# EAGLE schematic borrador_1 (EAGLE 9.5.2)

## Sheet 1 of 2
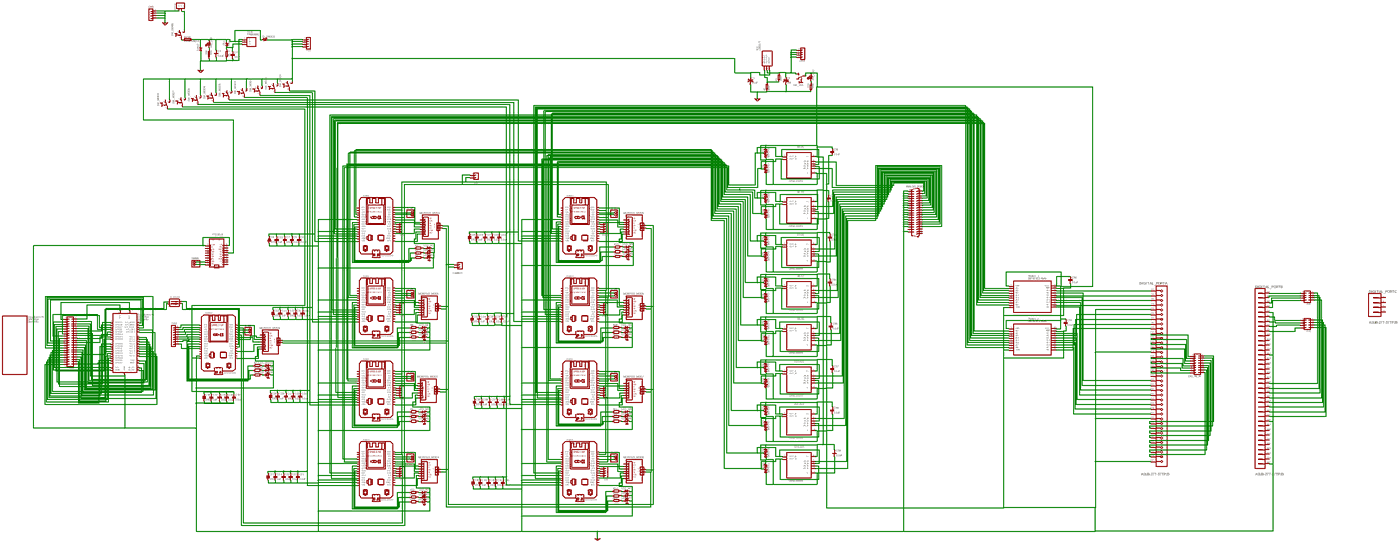
[diagram p0: schematic, sheet 1, overview]
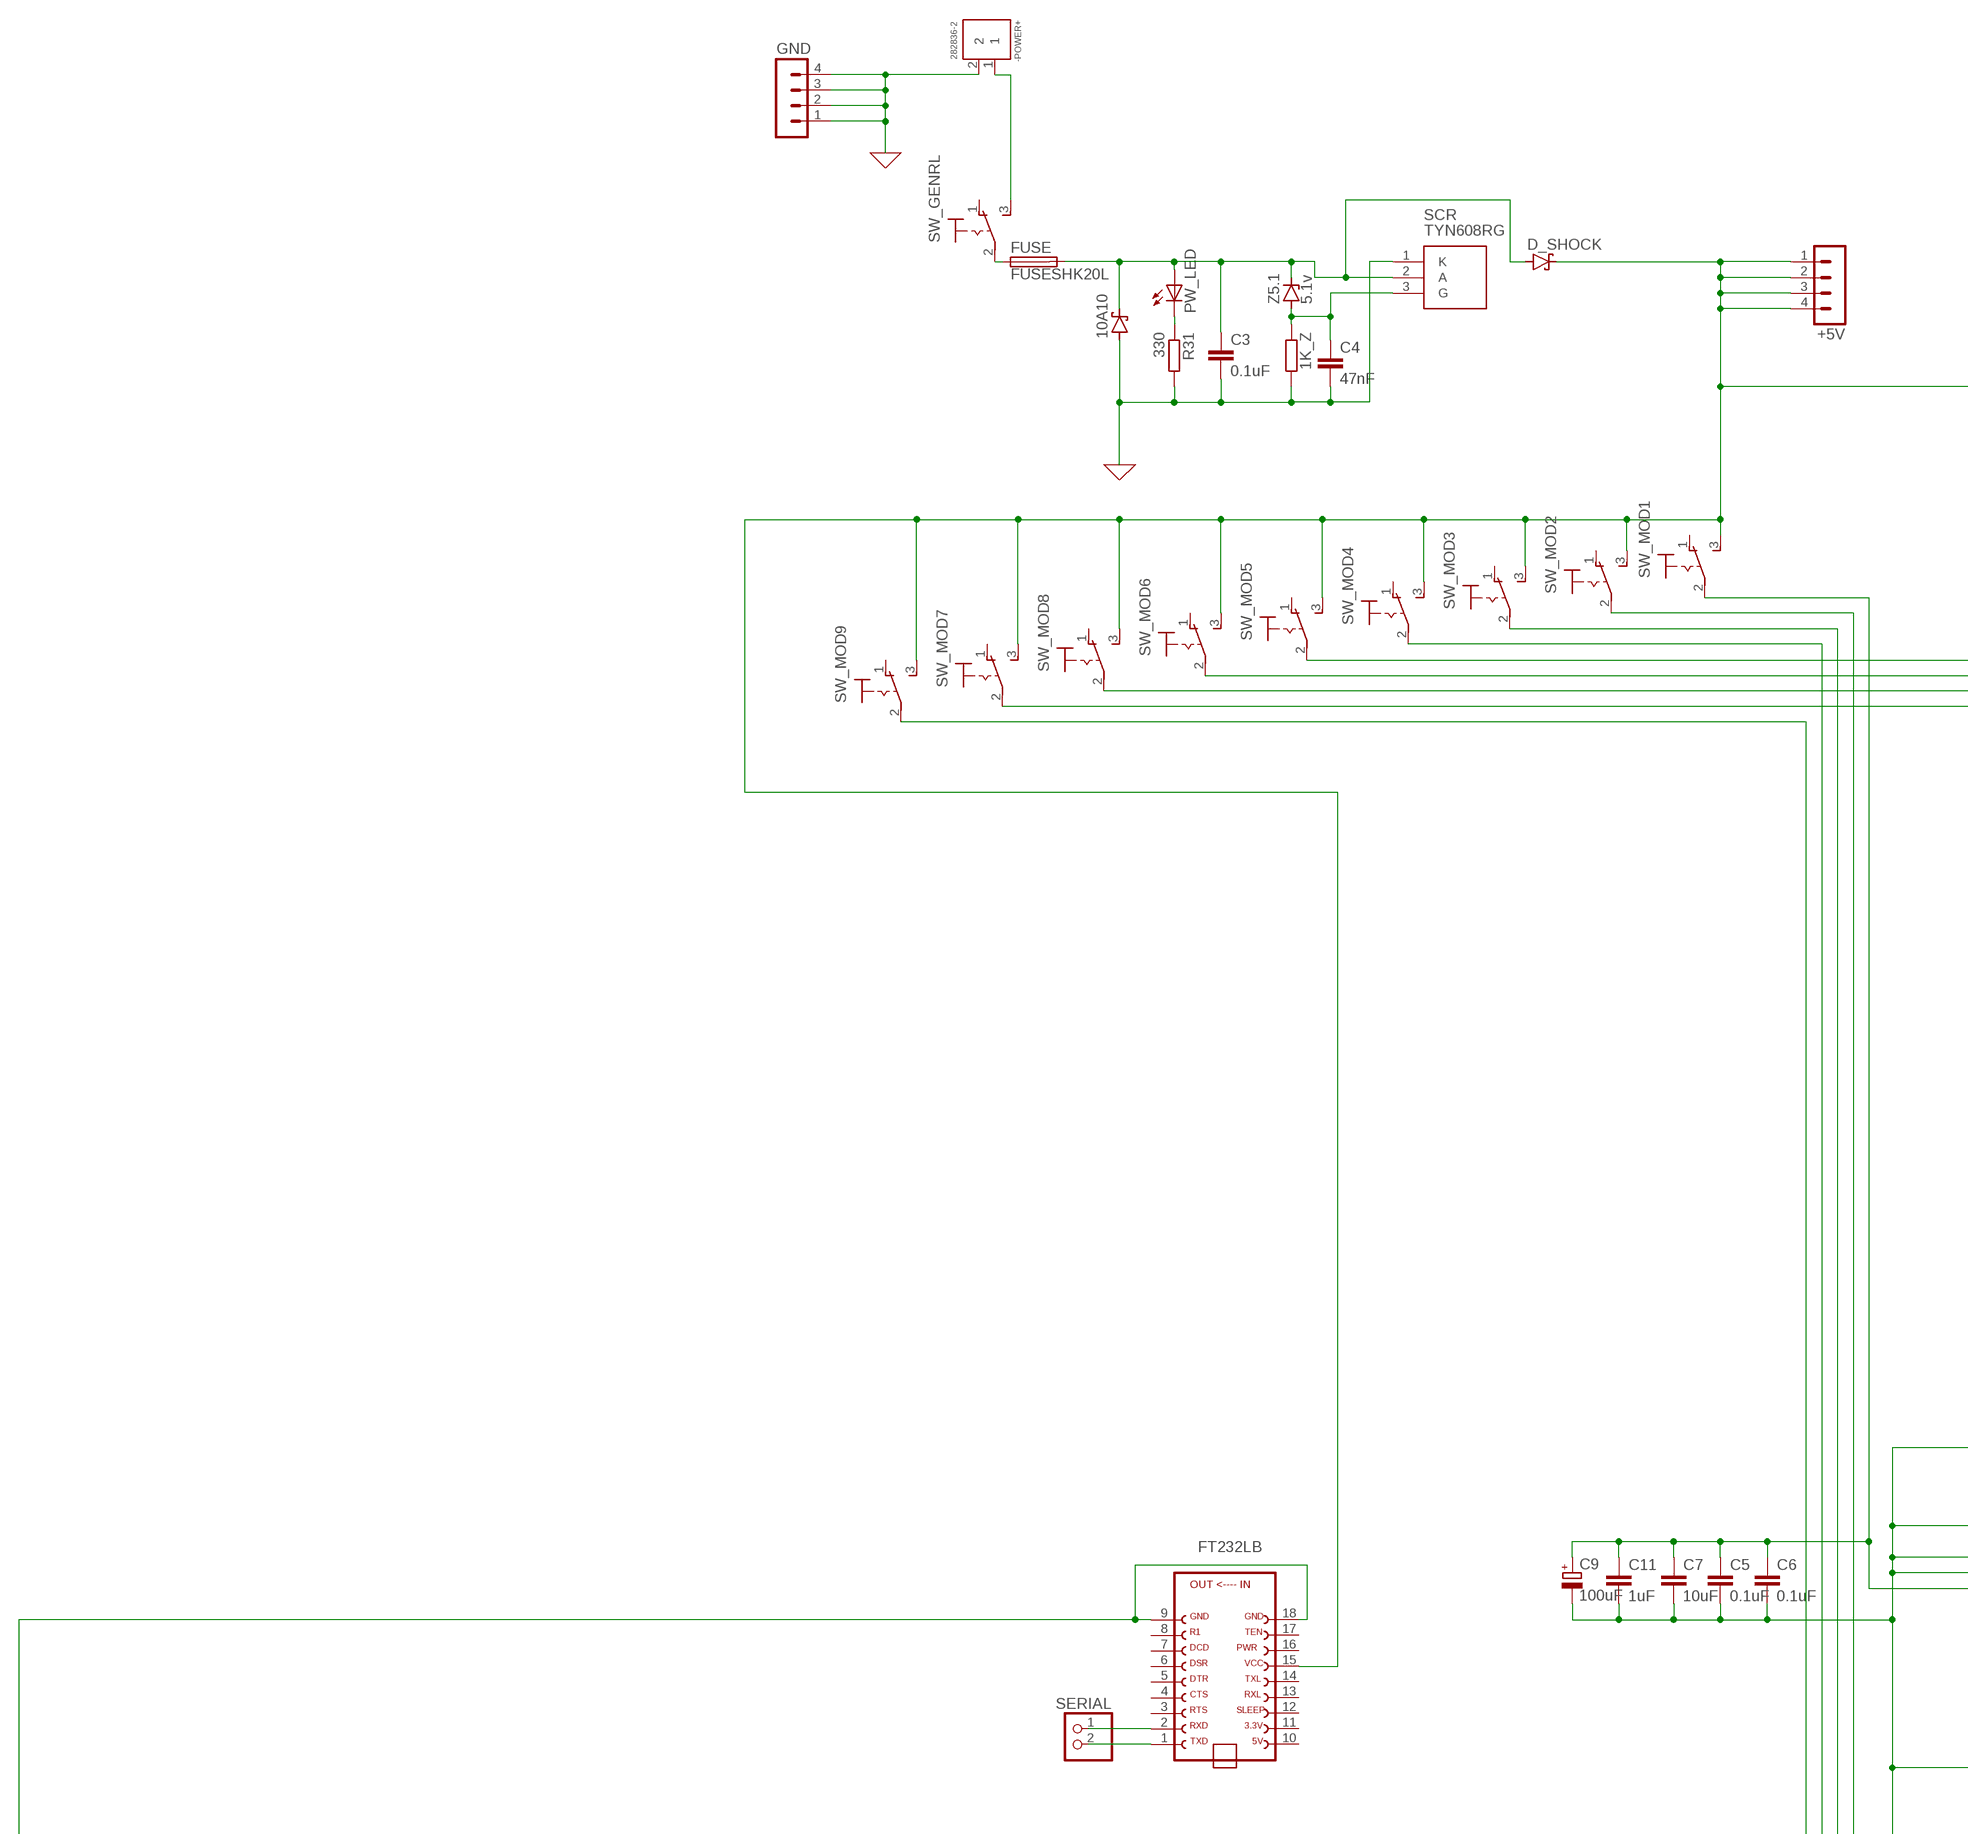
[diagram p1: schematic, sheet 1, part 1 of 6]
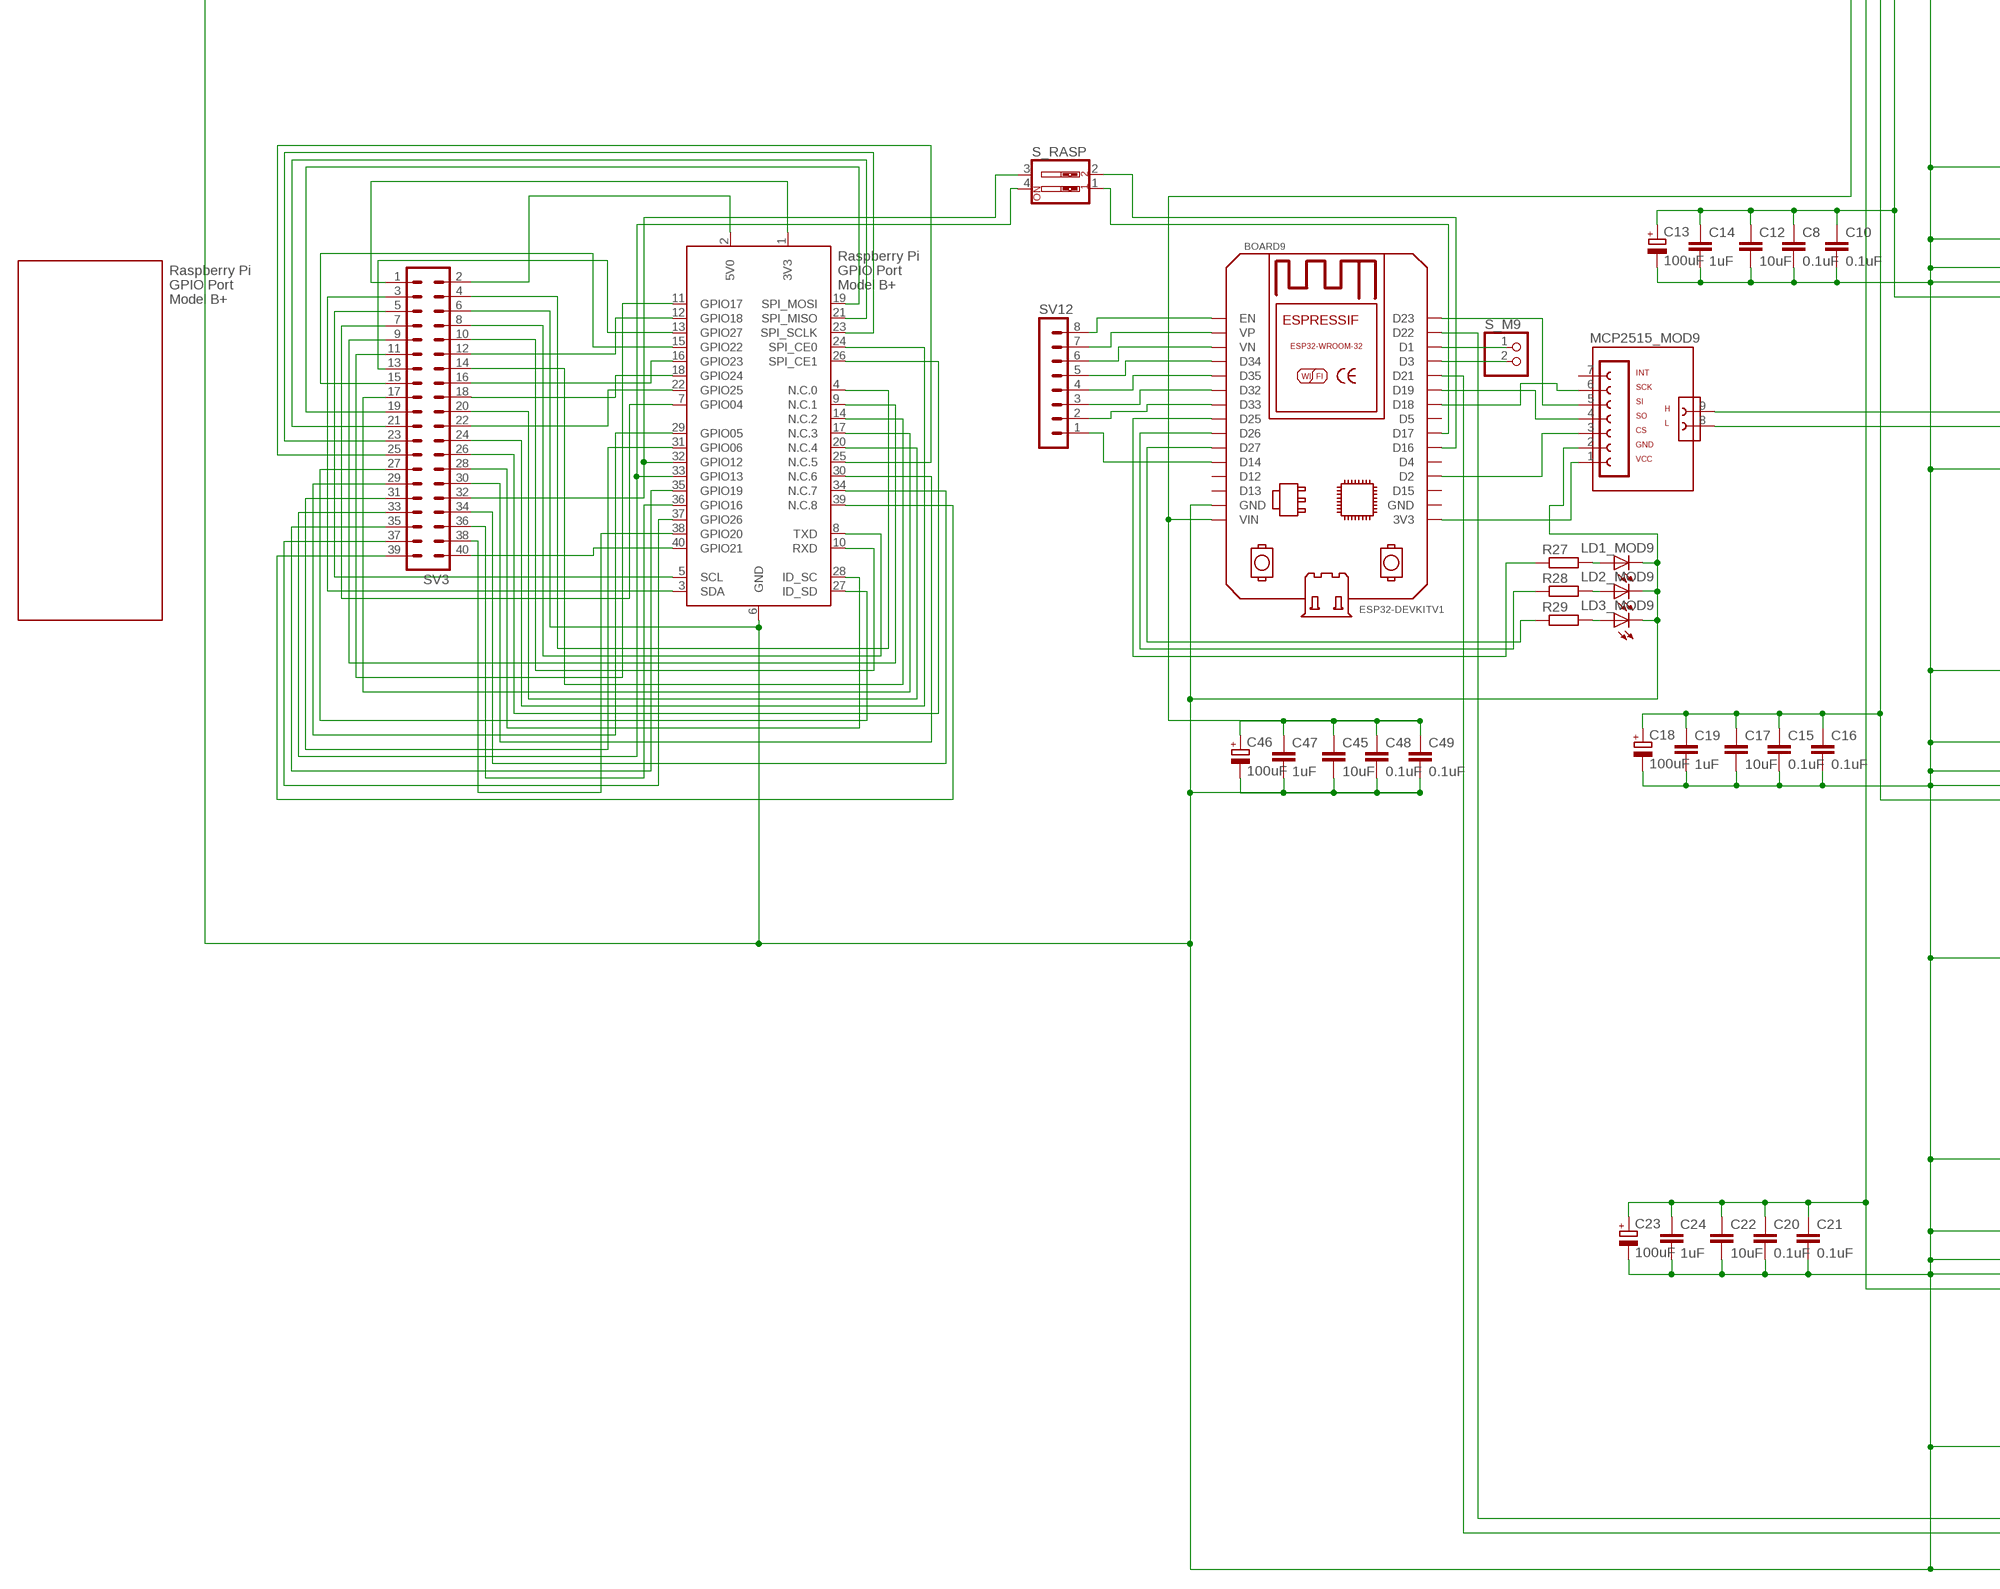
[diagram p2: schematic, sheet 1, part 2 of 6]
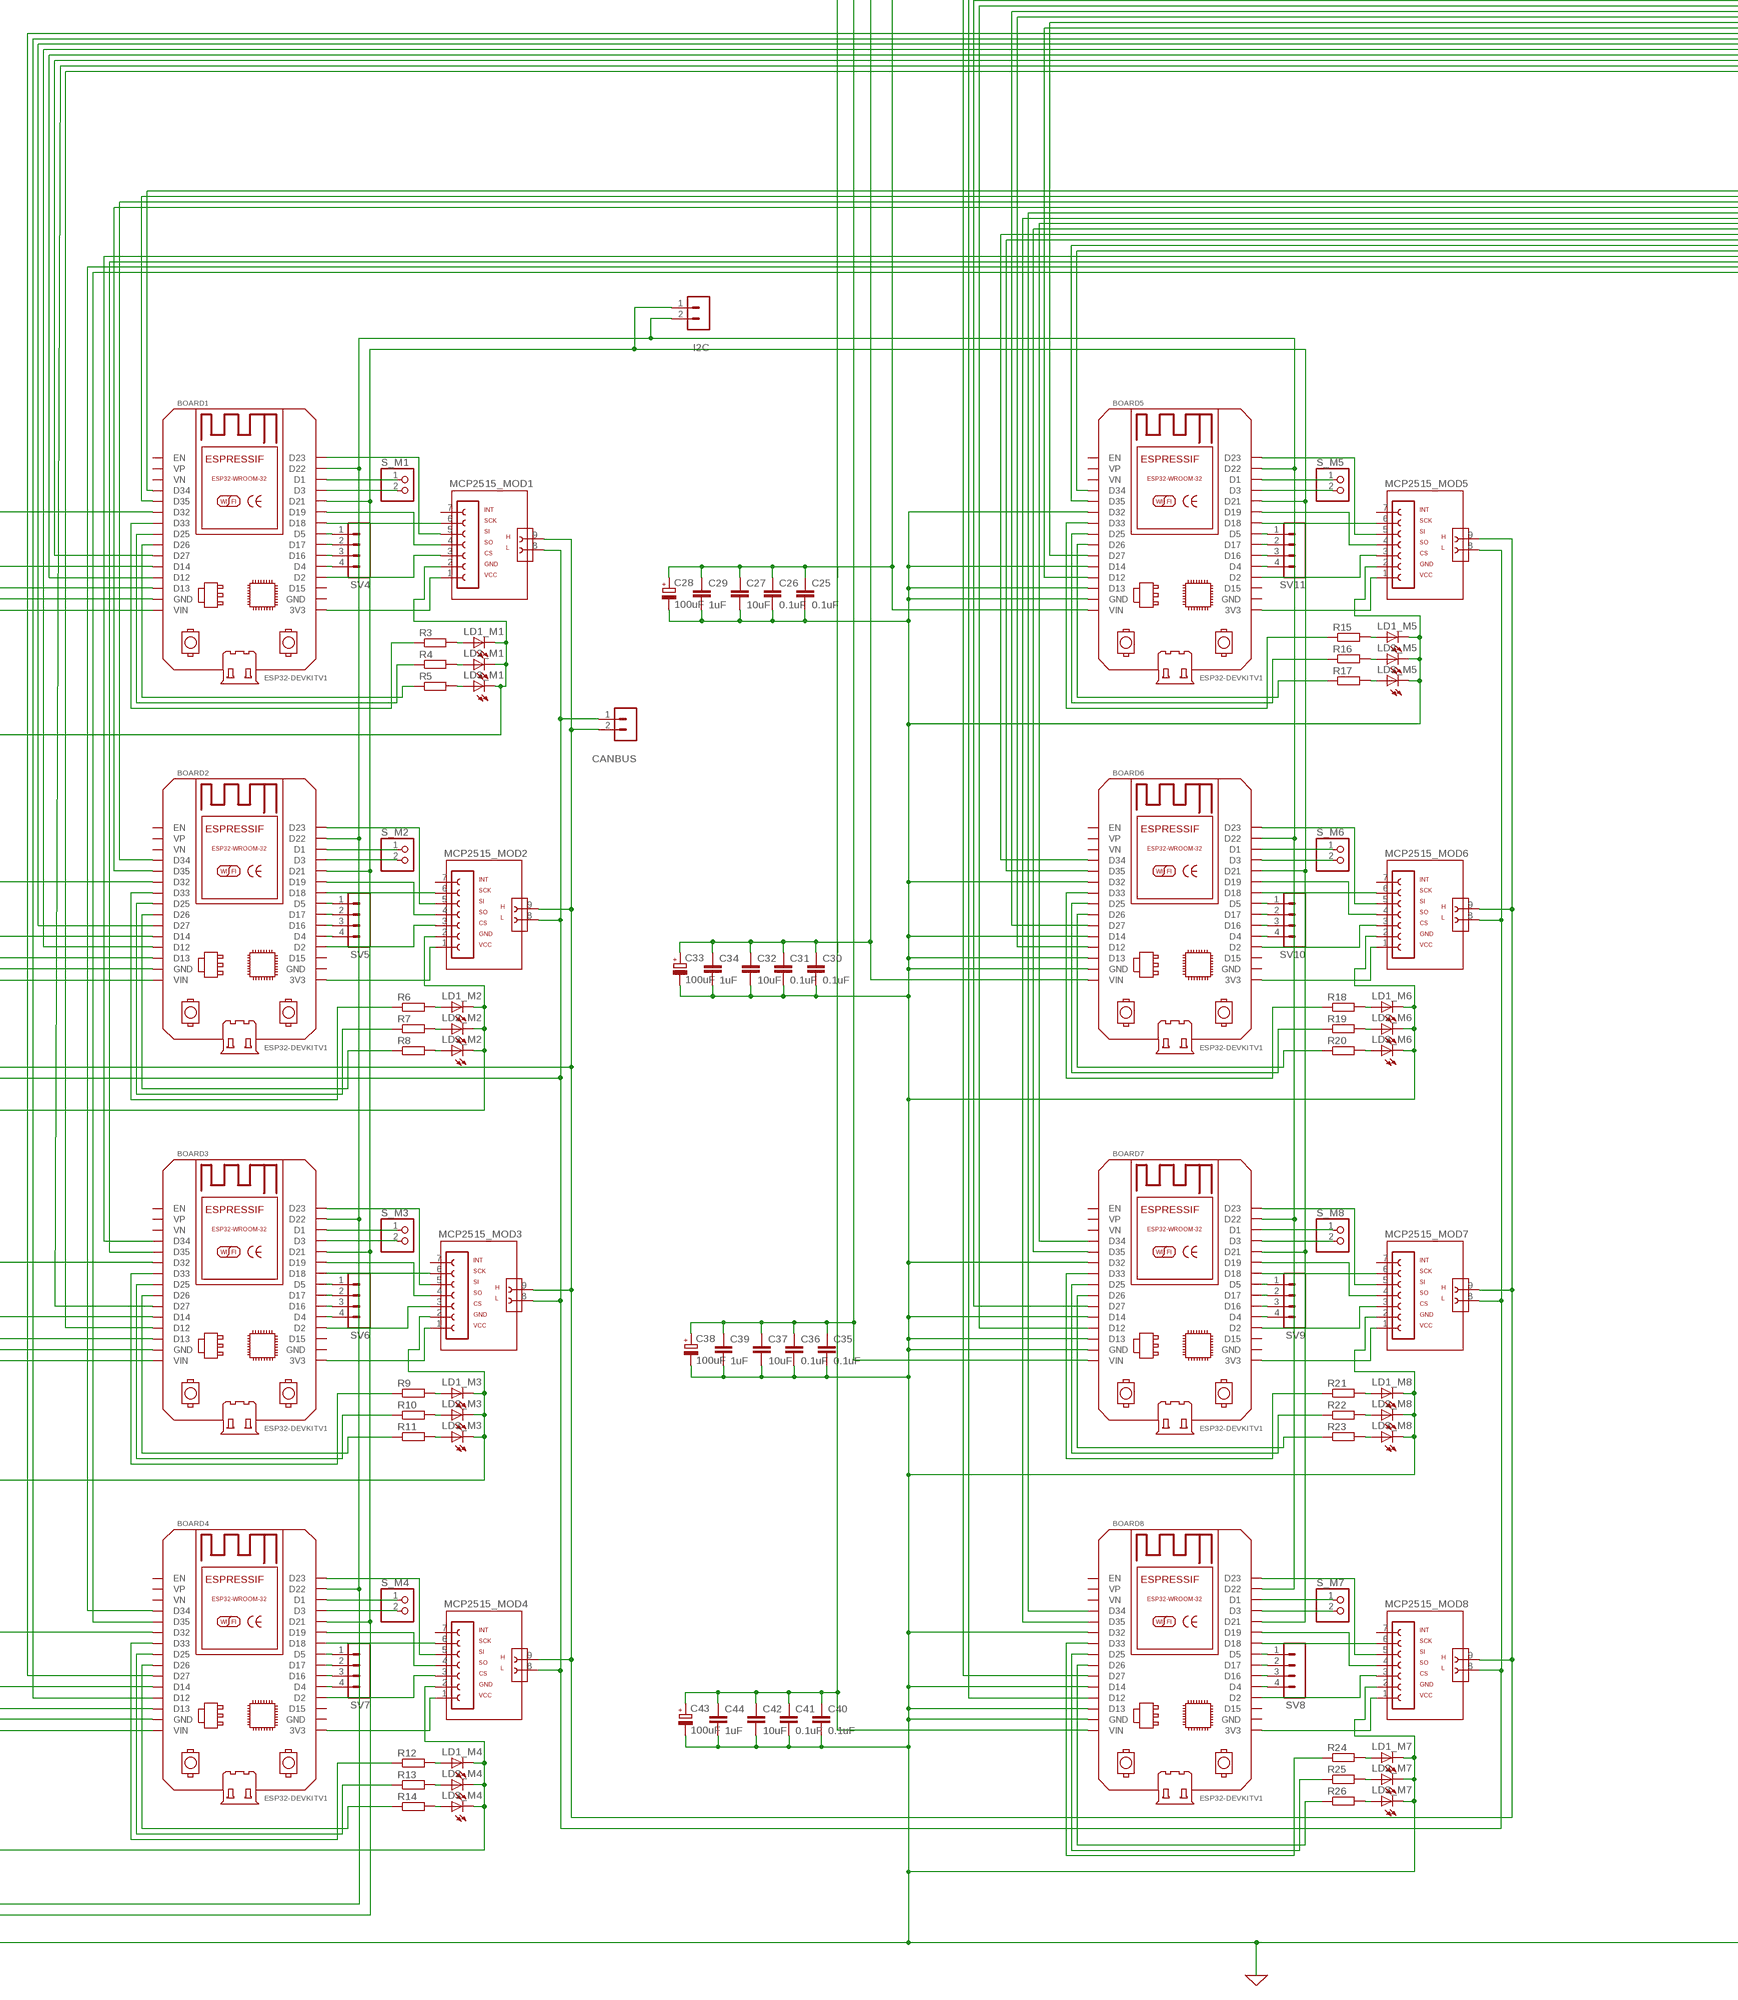
[diagram p3: schematic, sheet 1, part 3 of 6]
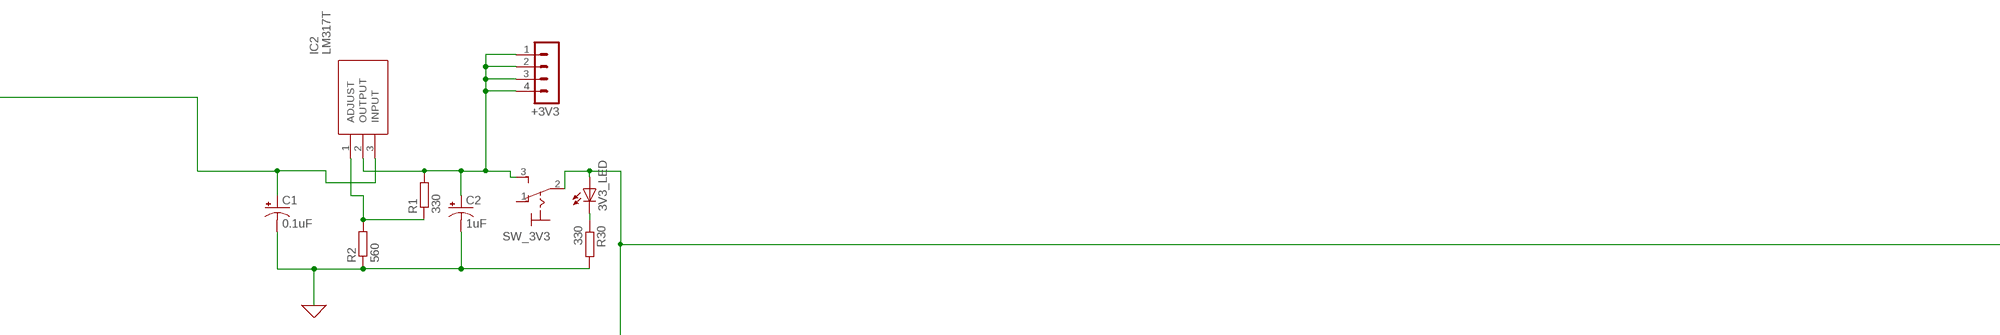
[diagram p4: schematic, sheet 1, part 4 of 6]
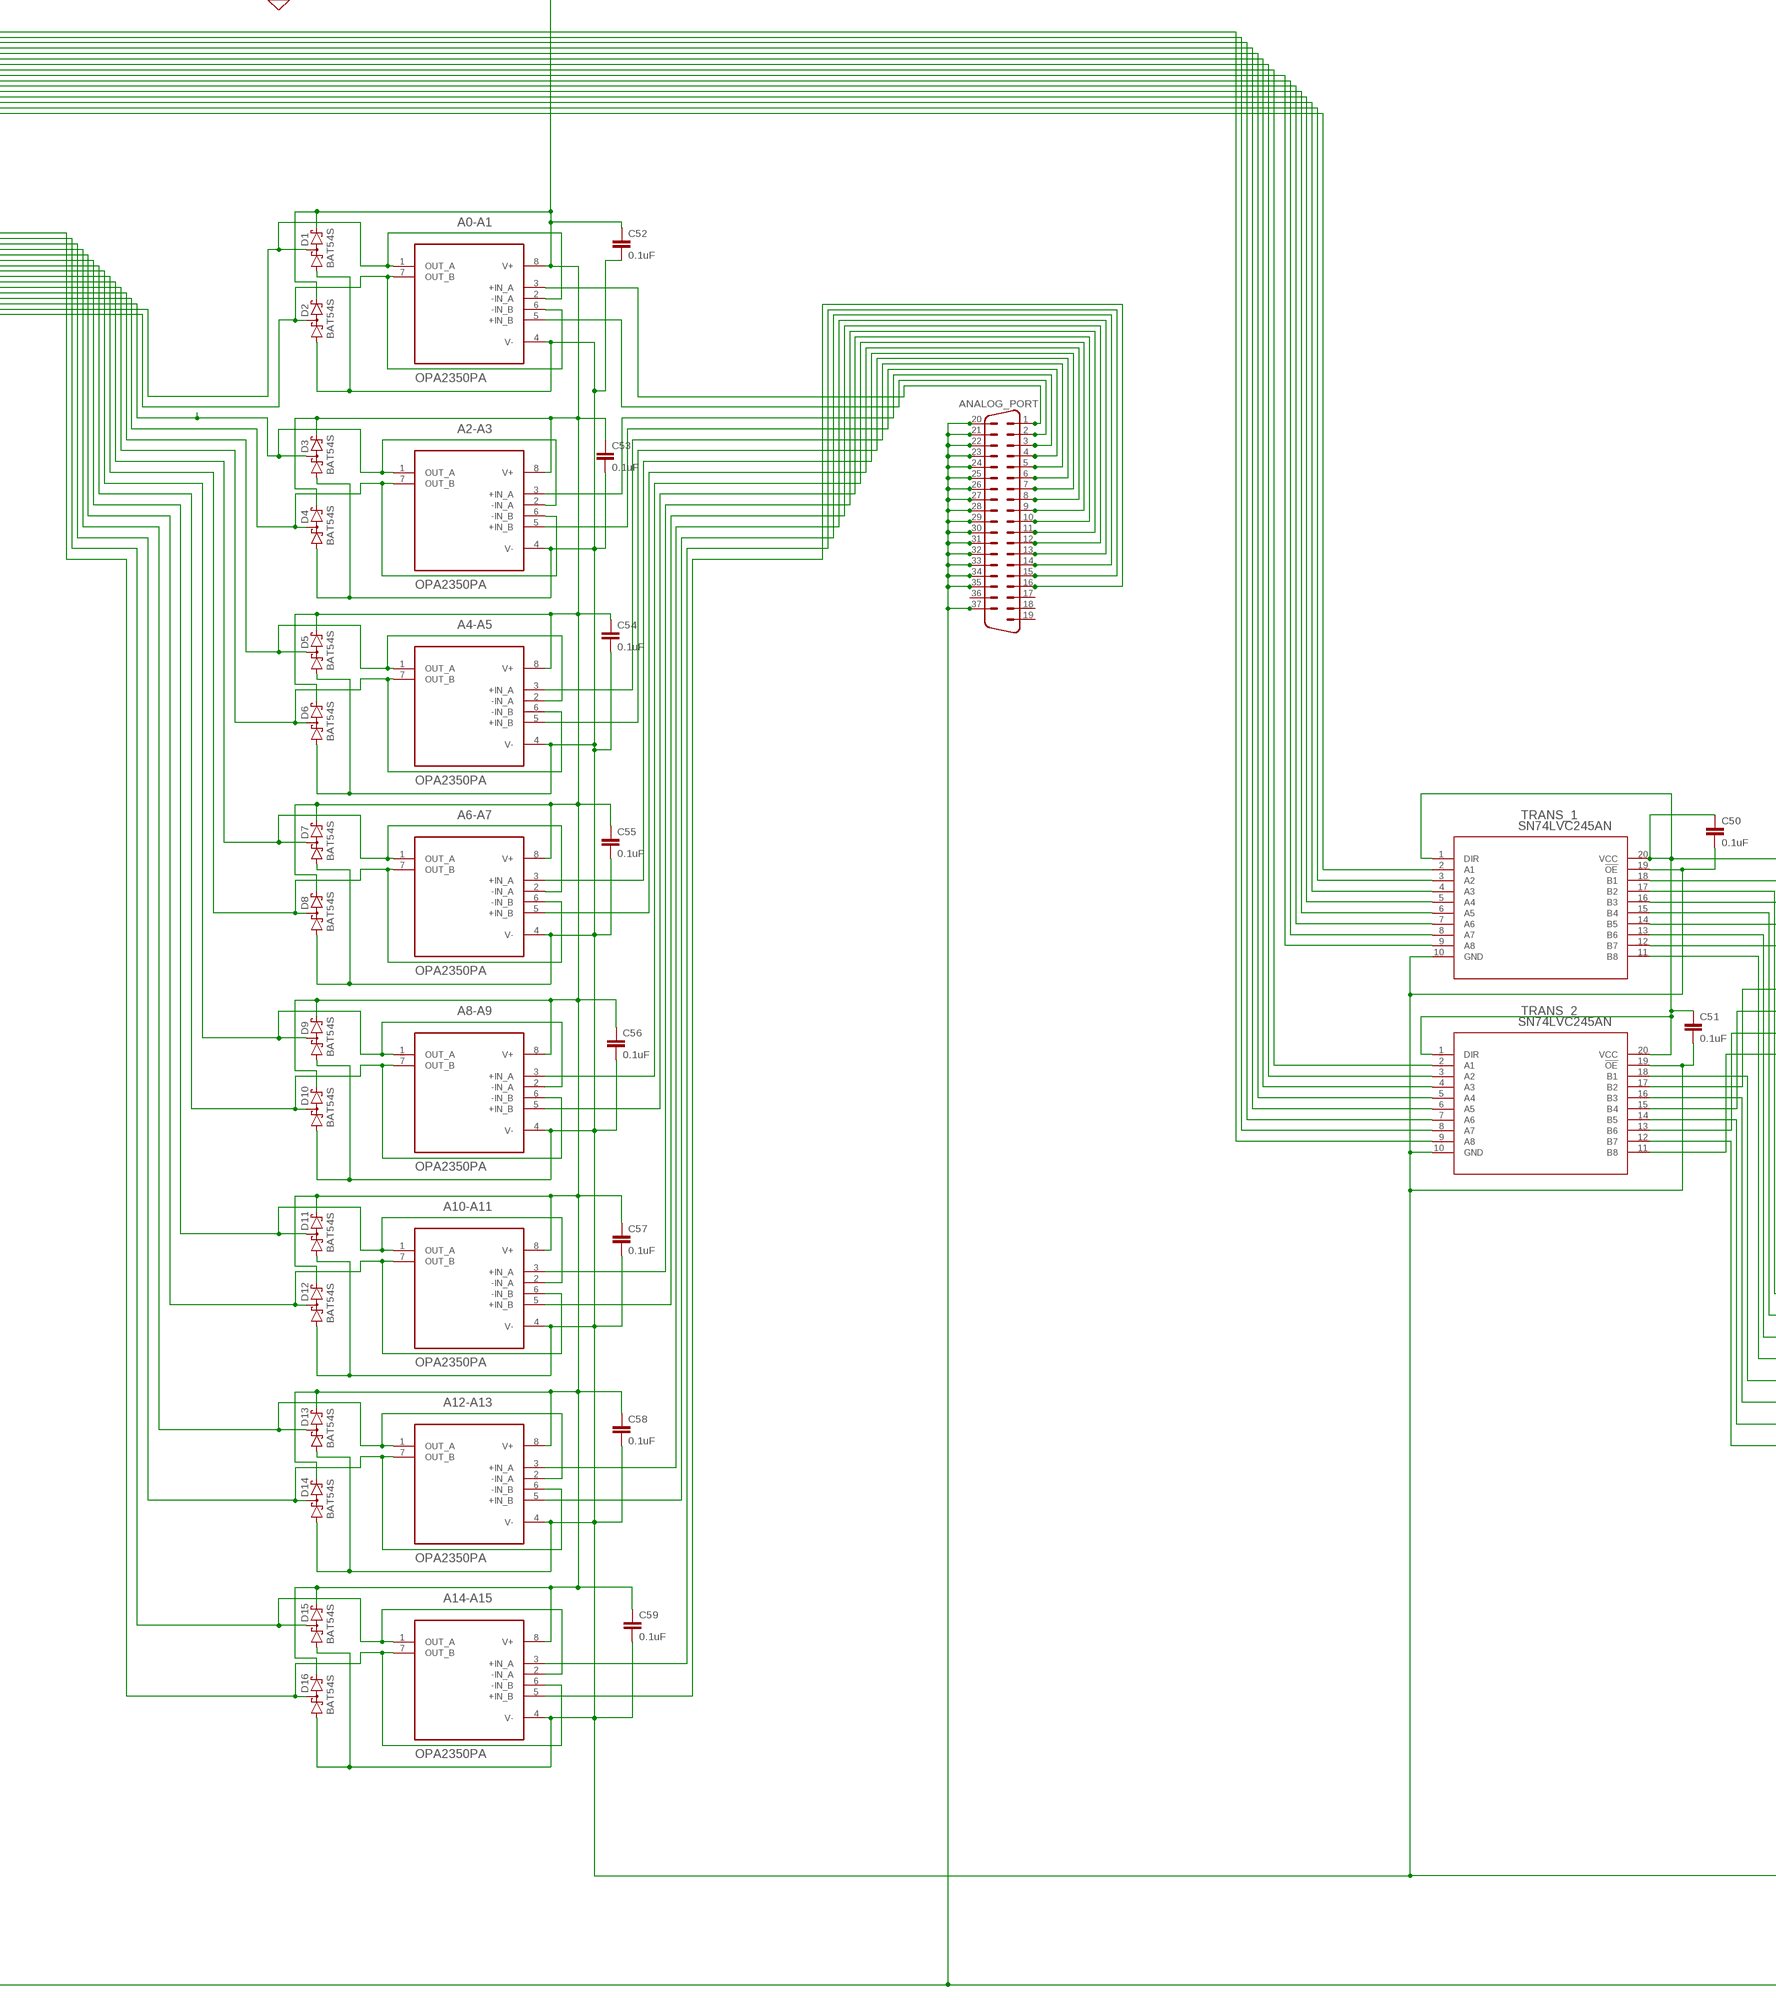
[diagram p5: schematic, sheet 1, part 5 of 6]
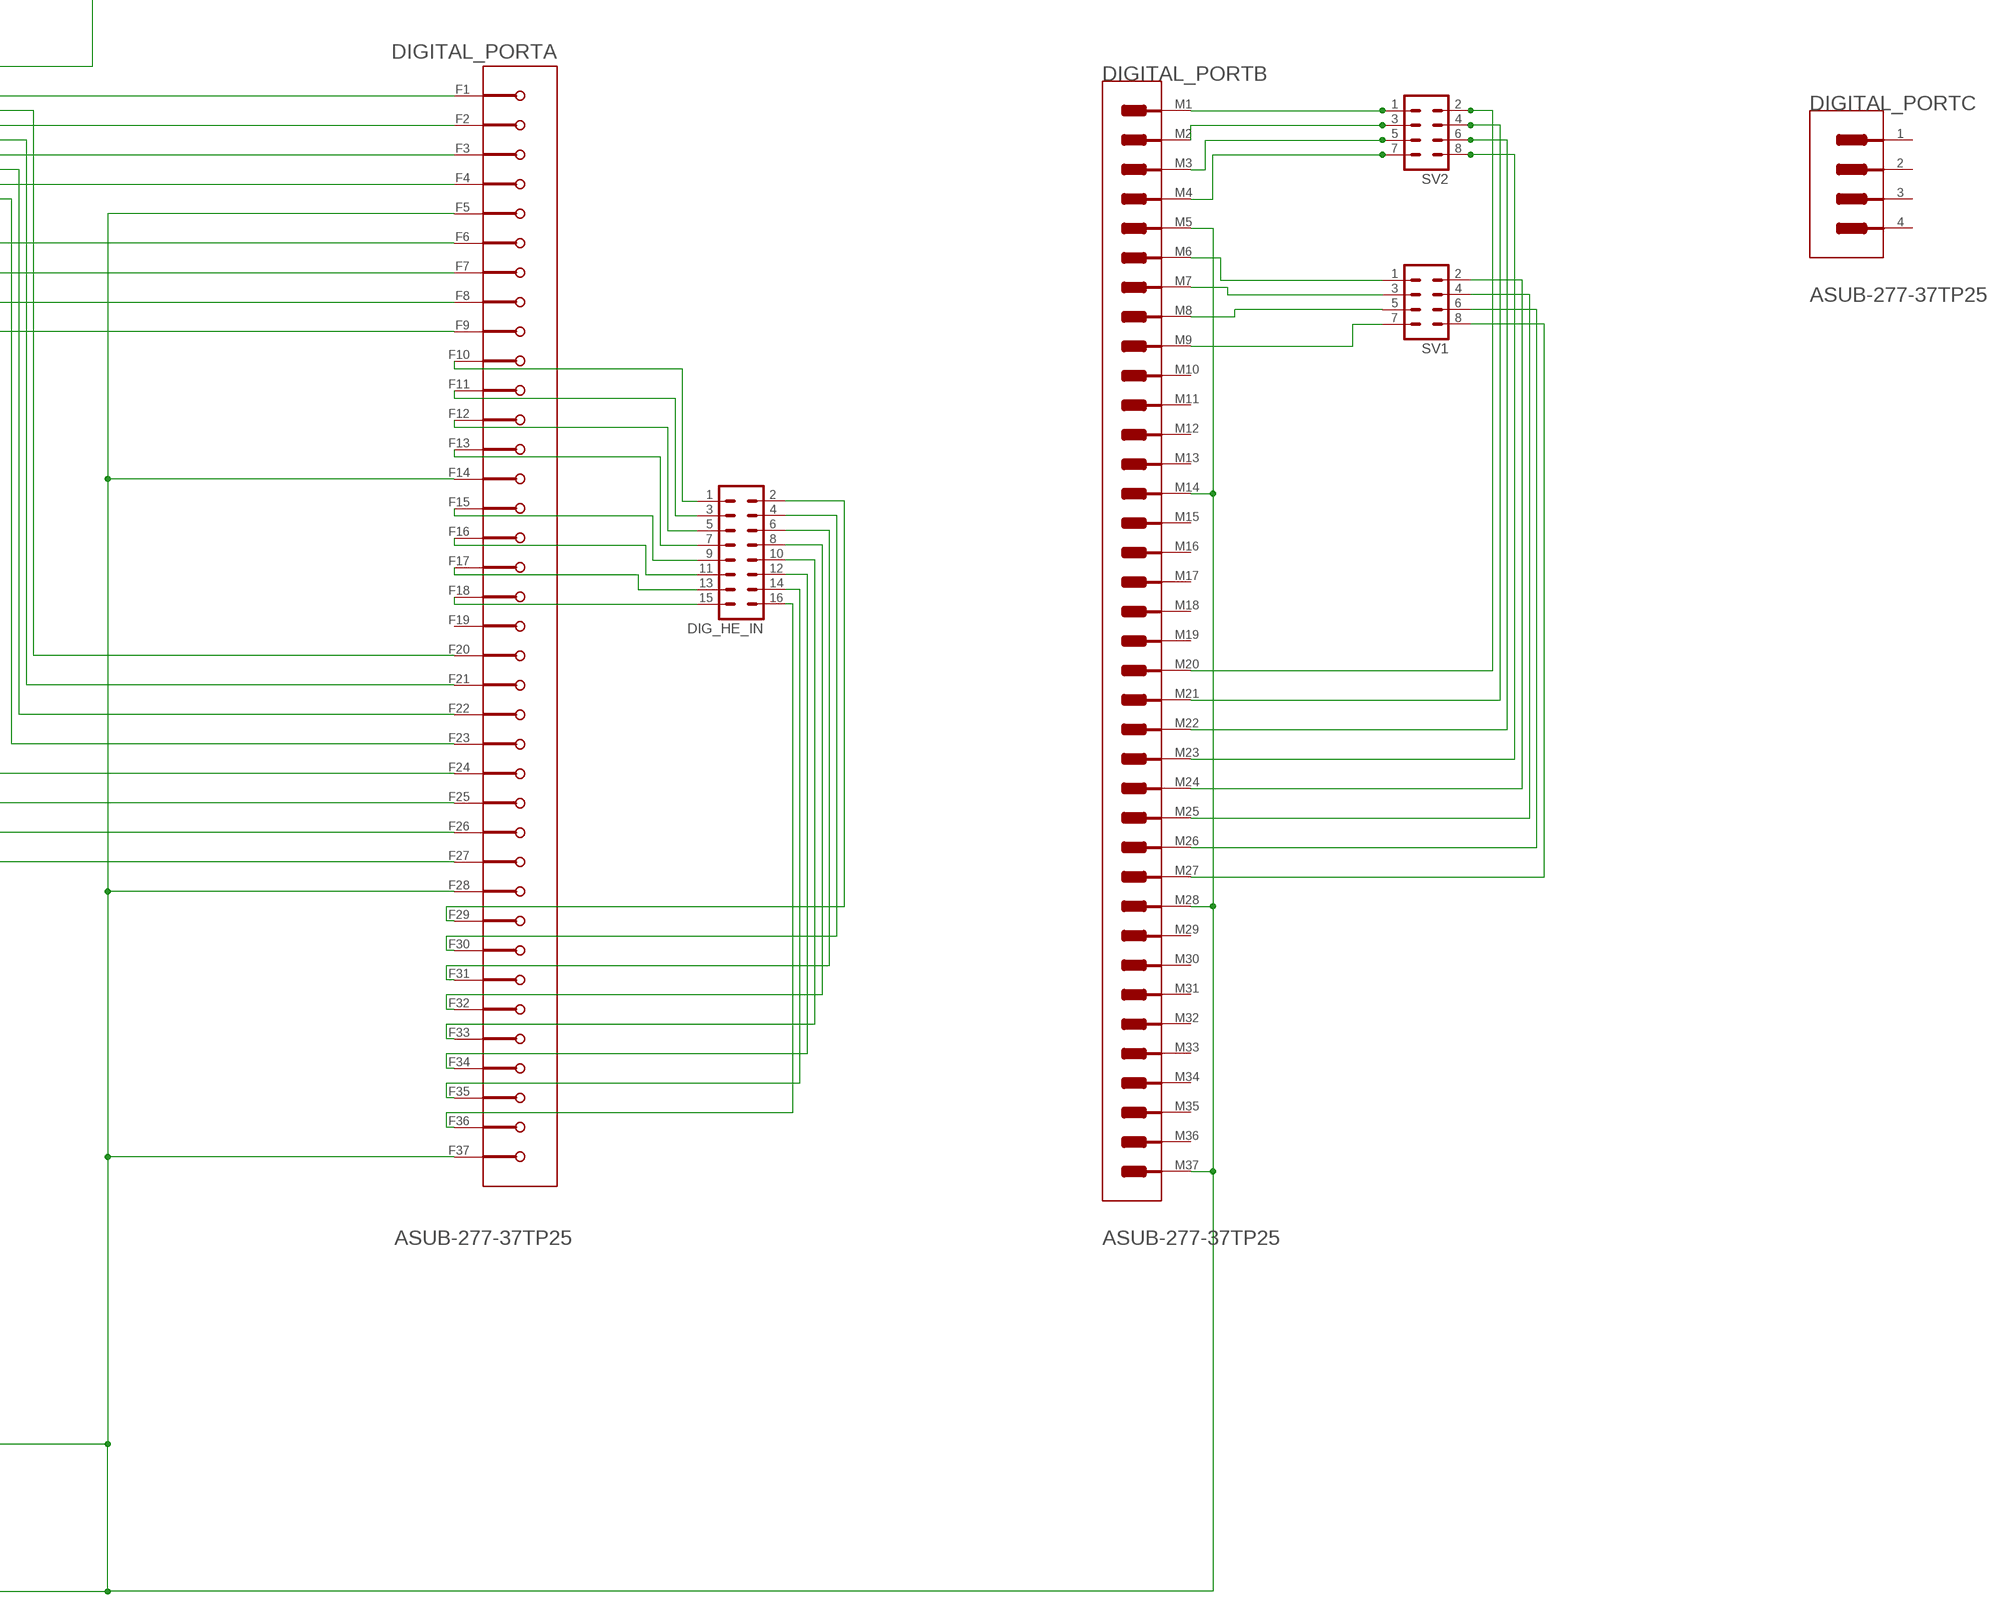
[diagram p6: schematic, sheet 1, part 6 of 6]

### Parts
1K_Z  R-EU_0207/10  [0207/10]
3V3_LED  LED3MM  [LED3MM]
10A10  SCHOTTKY-DIODECB429-15  [CB429-15]
+3V3  MA04-1  [MA04-1]
+5V  MA04-1  [MA04-1]
-POWER+  282836-2  [CONN_282836-2]
A0-A1  OPA2350PA  [DIP254P762X508-8]
A2-A3  OPA2350PA  [DIP254P762X508-8]
A4-A5  OPA2350PA  [DIP254P762X508-8]
A6-A7  OPA2350PA  [DIP254P762X508-8]
A8-A9  OPA2350PA  [DIP254P762X508-8]
A10-A11  OPA2350PA  [DIP254P762X508-8]
A12-A13  OPA2350PA  [DIP254P762X508-8]
A14-A15  OPA2350PA  [DIP254P762X508-8]
ANALOG_PORT  M37HP  [M37HP]
BOARD1  ESP32DEVKITV1  [ESP32-DEVKITV1]
BOARD2  ESP32DEVKITV1  [ESP32-DEVKITV1]
BOARD3  ESP32DEVKITV1  [ESP32-DEVKITV1]
BOARD4  ESP32DEVKITV1  [ESP32-DEVKITV1]
BOARD5  ESP32DEVKITV1  [ESP32-DEVKITV1]
BOARD6  ESP32DEVKITV1  [ESP32-DEVKITV1]
BOARD7  ESP32DEVKITV1  [ESP32-DEVKITV1]
BOARD8  ESP32DEVKITV1  [ESP32-DEVKITV1]
BOARD9  ESP32DEVKITV1  [ESP32-DEVKITV1]
C1  0.1uF  CPOL-USE2.5-6  [E2,5-6]
C2  1uF  CPOL-USE2.5-6  [E2,5-6]
C3  0.1uF  C-EU050-030X075  [C050-030X075]
C4  47nF  C-EU050-030X075  [C050-030X075]
C5  0.1uF  C-EU050-025X075  [C050-025X075]
C6  0.1uF  C-EU050-025X075  [C050-025X075]
C7  10uF  C-EU025-030X050  [C025-030X050]
C8  0.1uF  C-EU050-025X075  [C050-025X075]
C9  100uF  CPOL-EUE2.5-6  [E2,5-6]
C10  0.1uF  C-EU050-025X075  [C050-025X075]
C11  1uF  C-EU050-030X075  [C050-030X075]
C12  10uF  C-EU025-030X050  [C025-030X050]
C13  100uF  CPOL-EUE2.5-6  [E2,5-6]
C14  1uF  C-EU050-030X075  [C050-030X075]
C15  0.1uF  C-EU050-025X075  [C050-025X075]
C16  0.1uF  C-EU050-025X075  [C050-025X075]
C17  10uF  C-EU025-030X050  [C025-030X050]
C18  100uF  CPOL-EUE2.5-6  [E2,5-6]
C19  1uF  C-EU050-030X075  [C050-030X075]
C20  0.1uF  C-EU050-025X075  [C050-025X075]
C21  0.1uF  C-EU050-025X075  [C050-025X075]
C22  10uF  C-EU025-030X050  [C025-030X050]
C23  100uF  CPOL-EUE2.5-6  [E2,5-6]
C24  1uF  C-EU050-030X075  [C050-030X075]
C25  0.1uF  C-EU050-025X075  [C050-025X075]
C26  0.1uF  C-EU050-025X075  [C050-025X075]
C27  10uF  C-EU025-030X050  [C025-030X050]
C28  100uF  CPOL-EUE2.5-6  [E2,5-6]
C29  1uF  C-EU050-030X075  [C050-030X075]
C30  0.1uF  C-EU050-025X075  [C050-025X075]
C31  0.1uF  C-EU050-025X075  [C050-025X075]
C32  10uF  C-EU025-030X050  [C025-030X050]
C33  100uF  CPOL-EUE2.5-6  [E2,5-6]
C34  1uF  C-EU050-030X075  [C050-030X075]
C35  0.1uF  C-EU050-025X075  [C050-025X075]
C36  0.1uF  C-EU050-025X075  [C050-025X075]
C37  10uF  C-EU025-030X050  [C025-030X050]
C38  100uF  CPOL-EUE2.5-6  [E2,5-6]
C39  1uF  C-EU050-030X075  [C050-030X075]
C40  0.1uF  C-EU050-025X075  [C050-025X075]
C41  0.1uF  C-EU050-025X075  [C050-025X075]
C42  10uF  C-EU025-030X050  [C025-030X050]
C43  100uF  CPOL-EUE2.5-6  [E2,5-6]
C44  1uF  C-EU050-030X075  [C050-030X075]
C45  10uF  C-EU025-030X050  [C025-030X050]
C46  100uF  CPOL-EUE2.5-6  [E2,5-6]
C47  1uF  C-EU050-030X075  [C050-030X075]
C48  0.1uF  C-EU050-025X075  [C050-025X075]
C49  0.1uF  C-EU050-025X075  [C050-025X075]
C50  0.1uF  C-EU025-030X050  [C025-030X050]
C51  0.1uF  C-EU025-030X050  [C025-030X050]
C52  0.1uF  C-EU050-025X075  [C050-025X075]
C53  0.1uF  C-EU050-025X075  [C050-025X075]
C54  0.1uF  C-EU050-025X075  [C050-025X075]
C55  0.1uF  C-EU050-025X075  [C050-025X075]
C56  0.1uF  C-EU050-025X075  [C050-025X075]
C57  0.1uF  C-EU050-025X075  [C050-025X075]
C58  0.1uF  C-EU050-025X075  [C050-025X075]
C59  0.1uF  C-EU050-025X075  [C050-025X075]
CANBUS  MA02-1  [MA02-1]
D1  BAT54S  [SOT23]
D2  BAT54S  [SOT23]
D3  BAT54S  [SOT23]
D4  BAT54S  [SOT23]
D5  BAT54S  [SOT23]
D6  BAT54S  [SOT23]
D7  BAT54S  [SOT23]
D8  BAT54S  [SOT23]
D9  BAT54S  [SOT23]
D10  BAT54S  [SOT23]
D11  BAT54S  [SOT23]
D12  BAT54S  [SOT23]
D13  BAT54S  [SOT23]
D14  BAT54S  [SOT23]
D15  BAT54S  [SOT23]
D16  BAT54S  [SOT23]
D_SHOCK  SCHOTTKY-DIODECB429-15  [CB429-15]
DIG_HE_IN  MA08-2  [MA08-2]
DIGITAL_PORT  ASSMANN_WSW_COMPONENTS_ASUB-277-37TP25ASSMANN_WSW_COMPONENTS_ASUB-277-37TP25_0_0  [ASSMANN_WSW_COMPONENTS_ASUB-277-37TP25_0]
FT232LB  FT232BL  [FT232BL]
FUSE  FUSESHK20L  [SHK20L]
GND  MA04-1  [MA04-1]
I2C  MA02-1  [MA02-1]
IC2  LM317T  [TO255P460X1020X2008-3P]
LD1_M1  LED3MM  [LED3MM]
LD1_M2  LED3MM  [LED3MM]
LD1_M3  LED3MM  [LED3MM]
LD1_M4  LED3MM  [LED3MM]
LD1_M5  LED3MM  [LED3MM]
LD1_M6  LED3MM  [LED3MM]
LD1_M7  LED3MM  [LED3MM]
LD1_M8  LED3MM  [LED3MM]
LD1_MOD9  LED3MM  [LED3MM]
LD2_M1  LED3MM  [LED3MM]
LD2_M2  LED3MM  [LED3MM]
LD2_M3  LED3MM  [LED3MM]
LD2_M4  LED3MM  [LED3MM]
LD2_M5  LED3MM  [LED3MM]
LD2_M6  LED3MM  [LED3MM]
LD2_M7  LED3MM  [LED3MM]
LD2_M8  LED3MM  [LED3MM]
LD2_MOD9  LED3MM  [LED3MM]
LD3_M1  LED3MM  [LED3MM]
LD3_M2  LED3MM  [LED3MM]
LD3_M3  LED3MM  [LED3MM]
LD3_M4  LED3MM  [LED3MM]
LD3_M5  LED3MM  [LED3MM]
LD3_M6  LED3MM  [LED3MM]
LD3_M7  LED3MM  [LED3MM]
LD3_M8  LED3MM  [LED3MM]
LD3_MOD9  LED3MM  [LED3MM]
MCP2515_MOD1  MCP2515  [MCP2515]
MCP2515_MOD2  MCP2515  [MCP2515]
MCP2515_MOD3  MCP2515  [MCP2515]
MCP2515_MOD4  MCP2515  [MCP2515]
MCP2515_MOD5  MCP2515  [MCP2515]
MCP2515_MOD6  MCP2515  [MCP2515]
MCP2515_MOD7  MCP2515  [MCP2515]
MCP2515_MOD8  MCP2515  [MCP2515]
MCP2515_MOD9  MCP2515  [MCP2515]
PW_LED  LED3MM  [LED3MM]
R1  330  R-EU_0411/15  [0411/15]
R2  560  R-EU_0411/15  [0411/15]
R3  R-EU_0207/10  [0207/10]
R4  R-EU_0207/10  [0207/10]
R5  R-EU_0207/10  [0207/10]
R6  R-EU_0207/10  [0207/10]
R7  R-EU_0207/10  [0207/10]
R8  R-EU_0207/10  [0207/10]
R9  R-EU_0207/10  [0207/10]
R10  R-EU_0207/10  [0207/10]
R11  R-EU_0207/10  [0207/10]
R12  R-EU_0207/10  [0207/10]
R13  R-EU_0207/10  [0207/10]
R14  R-EU_0207/10  [0207/10]
R15  R-EU_0207/10  [0207/10]
R16  R-EU_0207/10  [0207/10]
R17  R-EU_0207/10  [0207/10]
R18  R-EU_0207/10  [0207/10]
R19  R-EU_0207/10  [0207/10]
R20  R-EU_0207/10  [0207/10]
R21  R-EU_0207/10  [0207/10]
R22  R-EU_0207/10  [0207/10]
R23  R-EU_0207/10  [0207/10]
R24  R-EU_0207/10  [0207/10]
R25  R-EU_0207/10  [0207/10]
R26  R-EU_0207/10  [0207/10]
R27  R-EU_0207/10  [0207/10]
R28  R-EU_0207/10  [0207/10]
R29  R-EU_0207/10  [0207/10]
R30  330  R-EU_0207/10  [0207/10]
R31  330  R-EU_0207/10  [0207/10]
S_M1  PINHD-1X2  [1X02]
S_M2  PINHD-1X2  [1X02]
S_M3  PINHD-1X2  [1X02]
S_M4  PINHD-1X2  [1X02]
S_M5  PINHD-1X2  [1X02]
S_M6  PINHD-1X2  [1X02]
S_M7  PINHD-1X2  [1X02]
S_M8  PINHD-1X2  [1X02]
S_M9  PINHD-1X2  [1X02]
S_RASP  SW_DIP-2  [EDG-02]
SCR  TYN608RG  [TO270P460X1020X2008-3P]
SERIAL  PINHD-1X2  [1X02]
SV1  MA04-2  [MA04-2]
SV2  MA04-2  [MA04-2]
SV3  MA20-2  [MA20-2]
SV4  MA04-1  [MA04-1]
SV5  MA04-1  [MA04-1]
SV6  MA04-1  [MA04-1]
SV7  MA04-1  [MA04-1]
SV8  MA04-1  [MA04-1]
SV9  MA04-1  [MA04-1]
SV10  MA04-1  [MA04-1]
SV11  MA04-1  [MA04-1]
SV12  MA08-1  [MA08-1]
SW_3V3  M9040P  [M9040P]
SW_GENRL  M9040P  [M9040P]
SW_MOD1  M9040P  [M9040P]
SW_MOD2  M9040P  [M9040P]
SW_MOD3  M9040P  [M9040P]
SW_MOD4  M9040P  [M9040P]
SW_MOD5  M9040P  [M9040P]
SW_MOD6  M9040P  [M9040P]
SW_MOD7  M9040P  [M9040P]
SW_MOD8  M9040P  [M9040P]
SW_MOD9  M9040P  [M9040P]
TRANS_1  SN74LVC245AN  [N20]
TRANS_2  SN74LVC245AN  [N20]
X1  RASPI_GPIO_B+_BOX  [RASPI_GPIO_B+_BOX]
X2  RASPI_BOARD_B+#_F  [RASPI_BOARD_B+_FULL]
Z5.1  5.1v  ZENER-DIODEDO41Z10  [DO41Z10]

### Nets
3V: +3V3.1 +3V3.2 +3V3.3 +3V3.4 C2.+ IC2.2(OUTPUT) R1.2 SW_3V3.3(S)
5V: +5V.1 +5V.2 +5V.3 +5V.4 C1.+ D_SHOCK.C FT232LB.15 IC2.3(INPUT) SW_MOD1.3(S) SW_MOD2.3(S) SW_MOD3.3(S) SW_MOD4.3(S) SW_MOD5.3(S) SW_MOD6.3(S) SW_MOD7.3(S) SW_MOD8.3(S) SW_MOD9.3(S)
5V_MOD1: BOARD1.VIN C5.1 C6.1 C7.1 C9.+ C11.1 SW_MOD1.2(P)
5V_MOD2: BOARD2.VIN C8.1 C10.1 C12.1 C13.+ C14.1 SW_MOD2.2(P)
5V_MOD3: BOARD3.VIN C15.1 C16.1 C17.1 C18.+ C19.1 SW_MOD3.2(P)
5V_MOD4: BOARD4.VIN C20.1 C21.1 C22.1 C23.+ C24.1 SW_MOD4.2(P)
5V_MOD5: BOARD5.VIN C25.1 C26.1 C27.1 C28.+ C29.1 SW_MOD5.2(P)
5V_MOD6: BOARD6.VIN C30.1 C31.1 C32.1 C33.+ C34.1 SW_MOD6.2(P)
5V_MOD7: BOARD7.VIN C35.1 C36.1 C37.1 C38.+ C39.1 SW_MOD8.2(P)
5V_MOD8: BOARD8.VIN C40.1 C41.1 C42.1 C43.+ C44.1 SW_MOD7.2(P)
5V_MOD9: BOARD9.VIN C45.1 C46.+ C47.1 C48.1 C49.1 SW_MOD9.2(P)
CAN_H: CANBUS.2 MCP2515_MOD1.9 MCP2515_MOD2.9 MCP2515_MOD3.9 MCP2515_MOD4.9 MCP2515_MOD5.9 MCP2515_MOD6.9 MCP2515_MOD7.9 MCP2515_MOD8.9 MCP2515_MOD9.9
CAN_L: CANBUS.1 MCP2515_MOD1.8 MCP2515_MOD2.8 MCP2515_MOD3.8 MCP2515_MOD4.8 MCP2515_MOD5.8 MCP2515_MOD6.8 MCP2515_MOD7.8 MCP2515_MOD8.8 MCP2515_MOD9.8
L_3V3: 3V3_LED.A A0-A1.8(V+) A2-A3.8(V+) A4-A5.8(V+) A6-A7.8(V+) A8-A9.8(V+) A10-A11.8(V+) A12-A13.8(V+) A14-A15.8(V+) C50.1 C51.1 C52.1 C53.1 C54.1 C55.1 C56.1 C57.1 C58.1 C59.1 D1.2(C2) D2.2(C2) D3.2(C2) D4.2(C2) D5.2(C2) D6.2(C2) D7.2(C2) D8.2(C2) D9.2(C2) D10.2(C2) D11.2(C2) D12.2(C2) D13.2(C2) D14.2(C2) D15.2(C2) D16.2(C2) SW_3V3.2(P) TRANS_1.1(DIR) TRANS_1.20(VCC) TRANS_2.1(DIR) TRANS_2.20(VCC)
L_AO_0: A0-A1.1(OUT_A) A0-A1.2(-IN_A) BOARD4.D34 D1.3(C1A2)
L_AO_0_P: A0-A1.3(+IN_A) ANALOG_PORT.1
L_AO_1: A0-A1.6(-IN_B) A0-A1.7(OUT_B) BOARD4.D35 D2.3(C1A2)
L_AO_1_P: A0-A1.5(+IN_B) ANALOG_PORT.2
L_AO_2: A2-A3.1(OUT_A) A2-A3.2(-IN_A) BOARD3.D35 D3.3(C1A2)
L_AO_2_P: A2-A3.3(+IN_A) ANALOG_PORT.3
L_AO_3: A2-A3.6(-IN_B) A2-A3.7(OUT_B) BOARD3.D34 D4.3(C1A2)
L_AO_3_P: A2-A3.5(+IN_B) ANALOG_PORT.4
L_AO_4: A4-A5.1(OUT_A) A4-A5.2(-IN_A) BOARD5.D34 D5.3(C1A2)
L_AO_4_P: A4-A5.3(+IN_A) ANALOG_PORT.5
L_AO_5: A4-A5.6(-IN_B) A4-A5.7(OUT_B) BOARD5.D35 D6.3(C1A2)
L_AO_5_P: A4-A5.5(+IN_B) ANALOG_PORT.6
L_AO_6: A6-A7.1(OUT_A) A6-A7.2(-IN_A) BOARD6.D35 D7.3(C1A2)
L_AO_6_P: A6-A7.3(+IN_A) ANALOG_PORT.7
L_AO_7: A6-A7.6(-IN_B) A6-A7.7(OUT_B) BOARD6.D34 D8.3(C1A2)
L_AO_7_P: A6-A7.5(+IN_B) ANALOG_PORT.8
L_AO_8: A8-A9.1(OUT_A) A8-A9.2(-IN_A) BOARD7.D35 D9.3(C1A2)
L_AO_8_P: A8-A9.3(+IN_A) ANALOG_PORT.9
L_AO_9: A8-A9.6(-IN_B) A8-A9.7(OUT_B) BOARD7.D34 D10.3(C1A2)
L_AO_9_P: A8-A9.5(+IN_B) ANALOG_PORT.10
L_AO_10: A10-A11.1(OUT_A) A10-A11.2(-IN_A) BOARD8.D35 D11.3(C1A2)
L_AO_10_P: A10-A11.3(+IN_A) ANALOG_PORT.11
L_AO_11: A10-A11.6(-IN_B) A10-A11.7(OUT_B) BOARD8.D34 D12.3(C1A2)
L_AO_11_P: A10-A11.5(+IN_B) ANALOG_PORT.12
L_AO_12: A12-A13.1(OUT_A) A12-A13.2(-IN_A) BOARD2.D35 D13.3(C1A2)
L_AO_12_P: A12-A13.3(+IN_A) ANALOG_PORT.13
L_AO_13: A12-A13.6(-IN_B) A12-A13.7(OUT_B) BOARD2.D34 D14.3(C1A2)
L_AO_13_P: A12-A13.5(+IN_B) ANALOG_PORT.14
L_AO_14: A14-A15.1(OUT_A) A14-A15.2(-IN_A) BOARD1.D35 D15.3(C1A2)
L_AO_14_P: A14-A15.3(+IN_A) ANALOG_PORT.15
L_AO_15: A14-A15.6(-IN_B) A14-A15.7(OUT_B) BOARD1.D34 D16.3(C1A2)
L_AO_15_P: A14-A15.5(+IN_B) ANALOG_PORT.16
L_DI_0: BOARD3.D12 TRANS_1.2(A1)
L_DI_0_P: DIGITAL_PORT.F1(A:F1) TRANS_1.18(B1)
L_DI_1: BOARD3.D27 TRANS_1.3(A2)
L_DI_1_P: DIGITAL_PORT.F20(A:F20) TRANS_1.17(B2)
L_DI_2: BOARD1.D27 TRANS_1.4(A3)
L_DI_2_P: DIGITAL_PORT.F2(A:F2) TRANS_1.16(B3)
L_DI_3: BOARD1.D12 TRANS_1.5(A4)
L_DI_3_P: DIGITAL_PORT.F21(A:F21) TRANS_1.15(B4)
L_DI_4: BOARD2.D12 TRANS_1.6(A5)
L_DI_4_P: DIGITAL_PORT.F3(A:F3) TRANS_1.14(B5)
L_DI_5: BOARD2.D27 TRANS_1.7(A6)
L_DI_5_P: DIGITAL_PORT.F22(A:F22) TRANS_1.13(B6)
L_DI_6: BOARD4.D12 TRANS_1.8(A7)
L_DI_6_P: DIGITAL_PORT.F4(A:F4) TRANS_1.12(B7)
L_DI_7: BOARD4.D27 TRANS_1.9(A8)
L_DI_7_P: DIGITAL_PORT.F23(A:F23) TRANS_1.11(B8)
L_DI_8: BOARD5.D12 TRANS_2.2(A1)
L_DI_8_P: DIGITAL_PORT.F24(A:F24) TRANS_2.18(B1)
L_DI_9: BOARD5.D27 TRANS_2.3(A2)
L_DI_9_P: DIGITAL_PORT.F6(A:F6) TRANS_2.17(B2)
L_DI_10: BOARD6.D12 TRANS_2.4(A3)
L_DI_10_P: DIGITAL_PORT.F25(A:F25) TRANS_2.16(B3)
L_DI_11: BOARD6.D27 TRANS_2.5(A4)
L_DI_11_P: DIGITAL_PORT.F7(A:F7) TRANS_2.15(B4)
L_DI_012: BOARD7.D12 TRANS_2.6(A5)
L_DI_12_P: DIGITAL_PORT.F26(A:F26) TRANS_2.14(B5)
L_DI_13: BOARD7.D27 TRANS_2.7(A6)
L_DI_13_P: DIGITAL_PORT.F8(A:F8) TRANS_2.13(B6)
L_DI_014: BOARD8.D12 TRANS_2.8(A7)
L_DI_14_P: DIGITAL_PORT.F27(A:F27) TRANS_2.12(B7)
L_DI_015: BOARD8.D27 TRANS_2.9(A8)
L_DI_15_P: DIGITAL_PORT.F9(A:F9) TRANS_2.11(B8)
L_DI_16_P: DIG_HE_IN.1 DIGITAL_PORT.F10(A:F10)
L_DI_17_P: DIG_HE_IN.2 DIGITAL_PORT.F29(A:F29)
L_DI_18_P: DIG_HE_IN.3 DIGITAL_PORT.F11(A:F11)
L_DI_19_P: DIG_HE_IN.4 DIGITAL_PORT.F30(A:F30)
L_DI_20_P: DIG_HE_IN.5 DIGITAL_PORT.F12(A:F12)
L_DI_21_P: DIG_HE_IN.6 DIGITAL_PORT.F31(A:F31)
L_DI_22_P: DIG_HE_IN.7 DIGITAL_PORT.F13(A:F13)
L_DI_23_P: DIG_HE_IN.8 DIGITAL_PORT.F32(A:F32)
L_DI_24_P: DIG_HE_IN.10 DIGITAL_PORT.F33(A:F33)
L_DI_25_P: DIG_HE_IN.9 DIGITAL_PORT.F15(A:F15)
L_DI_26_P: DIG_HE_IN.12 DIGITAL_PORT.F34(A:F34)
L_DI_27_P: DIG_HE_IN.11 DIGITAL_PORT.F16(A:F16)
L_DI_28_P: DIG_HE_IN.14 DIGITAL_PORT.F35(A:F35)
L_DI_29_P: DIG_HE_IN.13 DIGITAL_PORT.F17(A:F17)
L_DI_31_P: DIG_HE_IN.15 DIGITAL_PORT.F18(A:F18)
L_DO_0_P: DIGITAL_PORT.M1(B:M1) SV2.1
L_DO_1_P: DIGITAL_PORT.M20(B:M20) SV2.2
L_DO_2_P: DIGITAL_PORT.M2(B:M2) SV2.3
L_DO_3_P: DIGITAL_PORT.M21(B:M21) SV2.4
L_DO_4_P: DIGITAL_PORT.M3(B:M3) SV2.5
L_DO_5_P: DIGITAL_PORT.M22(B:M22) SV2.6
L_DO_6_P: DIGITAL_PORT.M4(B:M4) SV2.7
L_DO_7_P: DIGITAL_PORT.M23(B:M23) SV2.8
L_DO_8_P: DIGITAL_PORT.M24(B:M24) SV1.2
L_DO_9_P: DIGITAL_PORT.M6(B:M6) SV1.1
L_DO_10_P: DIGITAL_PORT.M25(B:M25) SV1.4
L_DO_11_P: DIGITAL_PORT.M7(B:M7) SV1.3
L_DO_12_P: DIGITAL_PORT.M26(B:M26) SV1.6
L_DO_13_P: DIGITAL_PORT.M8(B:M8) SV1.5
L_DO_14_P: DIGITAL_PORT.M27(B:M27) SV1.8
L_DO_15_P: DIGITAL_PORT.M9(B:M9) SV1.7
L_GROUND: 1K_Z.2 10A10.A -POWER+.2 A0-A1.4(V-) A2-A3.4(V-) A4-A5.4(V-) A6-A7.4(V-) A8-A9.4(V-) A10-A11.4(V-) A12-A13.4(V-) A14-A15.4(V-) ANALOG_PORT.20 ANALOG_PORT.21 ANALOG_PORT.22 ANALOG_PORT.23 ANALOG_PORT.24 ANALOG_PORT.25 ANALOG_PORT.26 ANALOG_PORT.27 ANALOG_PORT.28 ANALOG_PORT.29 ANALOG_PORT.30 ANALOG_PORT.31 ANALOG_PORT.32 ANALOG_PORT.33 ANALOG_PORT.34 ANALOG_PORT.35 ANALOG_PORT.37 BOARD1.D13 BOARD1.D14 BOARD1.D32 BOARD1.GND BOARD2.D13 BOARD2.D14 BOARD2.D32 BOARD2.GND BOARD3.D13 BOARD3.D14 BOARD3.D32 BOARD3.GND BOARD4.D13 BOARD4.D14 BOARD4.D32 BOARD4.GND BOARD5.D13 BOARD5.D14 BOARD5.D32 BOARD5.GND BOARD6.D13 BOARD6.D14 BOARD6.D32 BOARD6.GND BOARD7.D13 BOARD7.D14 BOARD7.D32 BOARD7.GND BOARD8.D13 BOARD8.D14 BOARD8.D32 BOARD8.GND BOARD9.GND C1.- C2.- C3.2 C4.2 C5.2 C6.2 C7.2 C8.2 C9.- C10.2 C11.2 C12.2 C13.- C14.2 C15.2 C16.2 C17.2 C18.- C19.2 C20.2 C21.2 C22.2 C23.- C24.2 C25.2 C26.2 C27.2 C28.- C29.2 C30.2 C31.2 C32.2 C33.- C34.2 C35.2 C36.2 C37.2 C38.- C39.2 C40.2 C41.2 C42.2 C43.- C44.2 C45.2 C46.- C47.2 C48.2 C49.2 C50.2 C51.2 C52.2 C53.2 C54.2 C55.2 C56.2 C57.2 C58.2 C59.2 D1.1(A1) D2.1(A1) D3.1(A1) D4.1(A1) D5.1(A1) D6.1(A1) D7.1(A1) D8.1(A1) D9.1(A1) D10.1(A1) D11.1(A1) D12.1(A1) D13.1(A1) D14.1(A1) D15.1(A1) D16.1(A1) DIGITAL_PORT.F5(A:F5) DIGITAL_PORT.F14(A:F14) DIGITAL_PORT.F28(A:F28) DIGITAL_PORT.F37(A:F37) DIGITAL_PORT.M5(B:M5) DIGITAL_PORT.M14(B:M14) DIGITAL_PORT.M28(B:M28) DIGITAL_PORT.M37(B:M37) FT232LB.9 FT232LB.18 GND.1 GND.2 GND.3 GND.4 LD1_M1.K(C) LD1_M2.K(C) LD1_M3.K(C) LD1_M4.K(C) LD1_M5.K(C) LD1_M6.K(C) LD1_M7.K(C) LD1_M8.K(C) LD1_MOD9.K(C) LD2_M1.K(C) LD2_M2.K(C) LD2_M3.K(C) LD2_M4.K(C) LD2_M5.K(C) LD2_M6.K(C) LD2_M7.K(C) LD2_M8.K(C) LD2_MOD9.K(C) LD3_M1.K(C) LD3_M2.K(C) LD3_M3.K(C) LD3_M4.K(C) LD3_M5.K(C) LD3_M6.K(C) LD3_M7.K(C) LD3_M8.K(C) LD3_MOD9.K(C) MCP2515_MOD1.2 MCP2515_MOD2.2 MCP2515_MOD3.2 MCP2515_MOD4.2 MCP2515_MOD5.2 MCP2515_MOD6.2 MCP2515_MOD7.2 MCP2515_MOD8.2 MCP2515_MOD9.2 R2.1 R30.2 R31.2 SCR.1(K) SV3.6 TRANS_1.10(GND) TRANS_1.19(!OE) TRANS_2.10(GND) TRANS_2.19(!OE) X1.6(GND) ; supply symbol labelled GND
L_SCL: BOARD1.D22 BOARD2.D22 BOARD3.D22 BOARD4.D22 BOARD5.D22 BOARD6.D22 BOARD7.D22 BOARD8.D22 BOARD9.D22 I2C.2
L_SDA: BOARD1.D21 BOARD2.D21 BOARD3.D21 BOARD4.D21 BOARD5.D21 BOARD6.D21 BOARD7.D21 BOARD8.D21 BOARD9.D21 I2C.1
N$1: BOARD1.3V3 MCP2515_MOD1.1
N$2: BOARD2.3V3 MCP2515_MOD2.1
N$3: IC2.1(ADJUST) R1.1 R2.2
N$4: PW_LED.K(C) R31.1
N$5: 1K_Z.1 C4.1 SCR.3(G) Z5.1.A
N$6: BOARD9.D23 MCP2515_MOD9.5
N$7: BOARD9.D19 MCP2515_MOD9.4
N$8: 3V3_LED.K(C) R30.1
N$10: FUSE.1A SW_GENRL.2(P)
N$11: DIG_HE_IN.16 DIGITAL_PORT.F36(A:F36)
N$15: BOARD3.3V3 MCP2515_MOD3.1
N$16: BOARD4.3V3 MCP2515_MOD4.1
N$17: BOARD5.3V3 MCP2515_MOD5.1
N$18: BOARD8.3V3 MCP2515_MOD8.1
N$19: BOARD7.3V3 MCP2515_MOD7.1
N$20: BOARD6.3V3 MCP2515_MOD6.1
N$21: SV3.1 X1.1(3V3)
N$22: BOARD1.D23 MCP2515_MOD1.5
N$23: BOARD1.D19 MCP2515_MOD1.4
N$24: BOARD1.D18 MCP2515_MOD1.6
N$25: SV3.2 X1.2(5V0)
N$26: SV3.3 X1.3(SDA)
N$27: BOARD9.3V3 MCP2515_MOD9.1
N$28: BOARD9.D18 MCP2515_MOD9.6
N$29: BOARD9.D2 MCP2515_MOD9.3
N$30: LD1_M2.A R6.2
N$31: BOARD1.D2 MCP2515_MOD1.3
N$32: BOARD2.D18 MCP2515_MOD2.6
N$33: BOARD2.D23 MCP2515_MOD2.5
N$34: BOARD2.D19 MCP2515_MOD2.4
N$35: SV3.4 X1.4(N.C.0)
N$36: LD1_M4.A R12.2
N$37: BOARD2.D2 MCP2515_MOD2.3
N$38: BOARD3.D23 MCP2515_MOD3.5
N$39: BOARD3.D18 MCP2515_MOD3.6
N$40: BOARD3.D19 MCP2515_MOD3.4
N$41: SV3.5 X1.5(SCL)
N$42: LD2_M4.A R13.2
N$43: BOARD3.D2 MCP2515_MOD3.3
N$44: BOARD4.D18 MCP2515_MOD4.6
N$45: BOARD4.D23 MCP2515_MOD4.5
N$46: BOARD4.D19 MCP2515_MOD4.4
N$47: SV3.7 X1.7(GPIO04)
N$48: BOARD4.D26 R14.1
N$49: BOARD4.D2 MCP2515_MOD4.3
N$50: SV3.8 X1.8(TXD)
N$51: LD1_M1.A R3.2
N$52: BOARD5.D18 MCP2515_MOD5.6
N$53: BOARD5.D23 MCP2515_MOD5.5
N$54: BOARD5.D19 MCP2515_MOD5.4
N$55: SV3.9 X1.9(N.C.1)
N$56: LD1_MOD9.A R27.2
N$57: BOARD5.D2 MCP2515_MOD5.3
N$58: BOARD6.D18 MCP2515_MOD6.6
N$59: BOARD6.D23 MCP2515_MOD6.5
N$60: BOARD6.D19 MCP2515_MOD6.4
N$61: SV3.10 X1.10(RXD)
N$62: LD2_MOD9.A R28.2
N$63: BOARD6.D2 MCP2515_MOD6.3
N$64: BOARD7.D18 MCP2515_MOD7.6
N$65: BOARD7.D23 MCP2515_MOD7.5
N$66: BOARD7.D19 MCP2515_MOD7.4
N$67: LD3_MOD9.A R29.2
N$68: BOARD7.D2 MCP2515_MOD7.3
N$69: BOARD8.D18 MCP2515_MOD8.6
N$70: BOARD8.D23 MCP2515_MOD8.5
N$71: BOARD8.D19 MCP2515_MOD8.4
N$72: SV3.11 X1.11(GPIO17)
N$73: BOARD9.D27 R29.1
N$74: BOARD8.D2 MCP2515_MOD8.3
N$75: LD2_M1.A R4.2
N$76: LD3_M1.A R5.2
N$77: BOARD1.D26 R5.1
N$78: BOARD1.D25 R4.1
N$79: BOARD1.D33 R3.1
N$80: LD2_M2.A R7.2
N$81: LD3_M2.A R8.2
N$82: BOARD2.D26 R8.1
N$83: BOARD2.D25 R7.1
N$84: BOARD2.D33 R6.1
N$85: LD1_M3.A R9.2
N$86: LD2_M3.A R10.2
N$87: LD3_M3.A R11.2
N$88: LD3_M4.A R14.2
N$89: BOARD4.D25 R13.1
N$90: BOARD4.D33 R12.1
N$91: BOARD3.D26 R11.1
N$92: BOARD3.D25 R10.1
N$93: BOARD3.D33 R9.1
N$94: LD1_M5.A R15.2
N$95: LD2_M5.A R16.2
N$96: LD3_M5.A R17.2
N$97: BOARD5.D26 R17.1
N$98: BOARD5.D25 R16.1
N$99: BOARD5.D33 R15.1
N$100: LD1_M6.A R18.2
N$101: LD2_M6.A R19.2
N$102: LD3_M6.A R20.2
N$103: BOARD6.D26 R20.1
N$104: BOARD6.D25 R19.1
N$105: BOARD6.D33 R18.1
N$106: LD1_M8.A R21.2
N$107: LD2_M8.A R22.2
N$108: LD3_M8.A R23.2
N$109: BOARD7.D26 R23.1
N$110: BOARD7.D25 R22.1
N$111: BOARD7.D33 R21.1
N$112: LD1_M7.A R24.2
N$113: LD2_M7.A R25.2
N$114: LD3_M7.A R26.2
N$115: BOARD8.D26 R26.1
N$116: BOARD8.D25 R25.1
N$117: BOARD8.D33 R24.1
N$118: BOARD9.D26 R28.1
N$119: BOARD9.D25 R27.1
N$120: SV3.12 X1.12(GPIO18)
N$121: SV3.13 X1.13(GPIO27)
N$122: SV3.14 X1.14(N.C.2)
N$123: SV3.15 X1.15(GPIO22)
N$124: SV3.16 X1.16(GPIO23)
N$125: SV3.17 X1.17(N.C.3)
N$126: SV3.18 X1.18(GPIO24)
N$127: SV3.19 X1.19(SPI_MOSI)
N$128: SV3.20 X1.20(N.C.4)
N$129: SV3.21 X1.21(SPI_MISO)
N$130: SV3.22 X1.22(GPIO25)
N$131: SV3.23 X1.23(SPI_SCLK)
N$132: SV3.24 X1.24(SPI_CE0)
N$133: SV3.25 X1.25(N.C.5)
N$134: SV3.26 X1.26(SPI_CE1)
N$135: SV3.27 X1.27(ID_SD)
N$136: SV3.28 X1.28(ID_SC)
N$137: SV3.29 X1.29(GPIO05)
N$138: SV3.30 X1.30(N.C.6)
N$139: SV3.31 X1.31(GPIO06)
N$140: SV3.34 X1.34(N.C.7)
N$141: SV3.35 X1.35(GPIO19)
N$142: SV3.36 X1.36(GPIO16)
N$143: SV3.37 X1.37(GPIO26)
N$144: SV3.38 X1.38(GPIO20)
N$145: SV3.39 X1.39(N.C.8)
N$146: SV3.40 X1.40(GPIO21)
N$147: BOARD9.D16 S_RASP.2
N$148: BOARD9.D17 S_RASP.1
N$149: BOARD1.D5 SV4.1
N$150: BOARD1.D17 SV4.2
N$151: BOARD1.D16 SV4.3
N$152: BOARD1.D4 SV4.4
N$153: BOARD2.D5 SV5.1
N$154: BOARD2.D17 SV5.2
N$155: BOARD2.D16 SV5.3
N$156: BOARD2.D4 SV5.4
N$157: BOARD3.D5 SV6.1
N$158: BOARD3.D17 SV6.2
N$159: BOARD3.D16 SV6.3
N$160: BOARD3.D4 SV6.4
N$161: BOARD4.D5 SV7.1
N$162: BOARD4.D17 SV7.2
N$163: BOARD4.D16 SV7.3
N$164: BOARD4.D4 SV7.4
N$165: BOARD8.D5 SV8.1
N$166: BOARD8.D17 SV8.2
N$167: BOARD8.D16 SV8.3
N$168: BOARD8.D4 SV8.4
N$169: BOARD7.D5 SV9.1
N$170: BOARD7.D17 SV9.2
N$171: BOARD7.D16 SV9.3
N$172: BOARD7.D4 SV9.4
N$173: BOARD6.D5 SV10.1
N$174: BOARD6.D17 SV10.2
N$175: BOARD6.D16 SV10.3
N$176: BOARD6.D4 SV10.4
N$177: BOARD5.D5 SV11.1
N$178: BOARD5.D17 SV11.2
N$179: BOARD5.D16 SV11.3
N$180: BOARD5.D4 SV11.4
N$181: BOARD9.VP SV12.7
N$182: BOARD9.VN SV12.6
N$183: BOARD9.D34 SV12.5
N$184: BOARD9.D35 SV12.4
N$185: BOARD9.D32 SV12.3
N$186: BOARD9.D33 SV12.2
N$187: BOARD9.D14 SV12.1
N$188: BOARD9.EN SV12.8
RX_FT232BL: FT232LB.2 SERIAL.1
TX_FT232BL: FT232LB.1 SERIAL.2
U0_RX_MOD1: BOARD1.D3 S_M1.2
U0_RX_MOD2: BOARD2.D3 S_M2.2
U0_RX_MOD3: BOARD3.D3 S_M3.2
U0_RX_MOD4: BOARD4.D3 S_M4.2
U0_RX_MOD5: BOARD5.D3 S_M5.2
U0_RX_MOD6: BOARD6.D3 S_M6.2
U0_RX_MOD7: BOARD7.D3 S_M8.2
U0_RX_MOD8: BOARD8.D3 S_M7.2
U0_RX_MOD9: BOARD9.D3 S_M9.2
U0_TX_MOD1: BOARD1.D1 S_M1.1
U0_TX_MOD2: BOARD2.D1 S_M2.1
U0_TX_MOD3: BOARD3.D1 S_M3.1
U0_TX_MOD4: BOARD4.D1 S_M4.1
U0_TX_MOD5: BOARD5.D1 S_M5.1
U0_TX_MOD6: BOARD6.D1 S_M6.1
U0_TX_MOD7: BOARD7.D1 S_M8.1
U0_TX_MOD8: BOARD8.D1 S_M7.1
U0_TX_MOD9: BOARD9.D1 S_M9.1
U2_RX_MOD9: S_RASP.3 SV3.32 X1.32(GPIO12)
U2_TX_MOD9: S_RASP.4 SV3.33 X1.33(GPIO13)
VCC_5V: -POWER+.1 SW_GENRL.3(S)
VCC_5V_2: 10A10.C C3.1 D_SHOCK.A FUSE.2A PW_LED.A SCR.2(A) Z5.1.C
Unconnected: ANALOG_PORT.17 ANALOG_PORT.18 ANALOG_PORT.19 ANALOG_PORT.36 BOARD1.D15 BOARD1.EN BOARD1.GND@1(GND) BOARD1.VN BOARD1.VP BOARD2.D15 BOARD2.EN BOARD2.GND@1(GND) BOARD2.VN BOARD2.VP BOARD3.D15 BOARD3.EN BOARD3.GND@1(GND) BOARD3.VN BOARD3.VP BOARD4.D15 BOARD4.EN BOARD4.GND@1(GND) BOARD4.VN BOARD4.VP BOARD5.D15 BOARD5.EN BOARD5.GND@1(GND) BOARD5.VN BOARD5.VP BOARD6.D15 BOARD6.EN BOARD6.GND@1(GND) BOARD6.VN BOARD6.VP BOARD7.D15 BOARD7.EN BOARD7.GND@1(GND) BOARD7.VN BOARD7.VP BOARD8.D15 BOARD8.EN BOARD8.GND@1(GND) BOARD8.VN BOARD8.VP BOARD9.D4 BOARD9.D5 BOARD9.D12 BOARD9.D13 BOARD9.D15 BOARD9.GND@1(GND) DIGITAL_PORT.1(C:MNT_1) DIGITAL_PORT.2(C:MNT_2) DIGITAL_PORT.3(C:MNT_3) DIGITAL_PORT.4(C:MNT_4) DIGITAL_PORT.F19(A:F19) DIGITAL_PORT.M10(B:M10) DIGITAL_PORT.M11(B:M11) DIGITAL_PORT.M12(B:M12) DIGITAL_PORT.M13(B:M13) DIGITAL_PORT.M15(B:M15) DIGITAL_PORT.M16(B:M16) DIGITAL_PORT.M17(B:M17) DIGITAL_PORT.M18(B:M18) DIGITAL_PORT.M19(B:M19) DIGITAL_PORT.M29(B:M29) DIGITAL_PORT.M30(B:M30) DIGITAL_PORT.M31(B:M31) DIGITAL_PORT.M32(B:M32) DIGITAL_PORT.M33(B:M33) DIGITAL_PORT.M34(B:M34) DIGITAL_PORT.M35(B:M35) DIGITAL_PORT.M36(B:M36) FT232LB.3 FT232LB.4 FT232LB.5 FT232LB.6 FT232LB.7 FT232LB.8 FT232LB.10 FT232LB.11 FT232LB.12 FT232LB.13 FT232LB.14 FT232LB.16 FT232LB.17 MCP2515_MOD1.7 MCP2515_MOD2.7 MCP2515_MOD3.7 MCP2515_MOD4.7 MCP2515_MOD5.7 MCP2515_MOD6.7 MCP2515_MOD7.7 MCP2515_MOD8.7 MCP2515_MOD9.7 SW_3V3.1(O) SW_GENRL.1(O) SW_MOD1.1(O) SW_MOD2.1(O) SW_MOD3.1(O) SW_MOD4.1(O) SW_MOD5.1(O) SW_MOD6.1(O) SW_MOD7.1(O) SW_MOD8.1(O) SW_MOD9.1(O)

## Sheet 2 of 2

## Library data of the parts
1K_Z R1-R31 = resistor:R-EU_: RESISTOR, European symbol
3V3_LED LD1_M1-LD1_M8 LD1_MOD9 LD2_M1-LD2_M8 LD2_MOD9 LD3_M1-LD3_M8 LD3_MOD9 PW_LED = led:LED: LED OSRAM: - CHIPLED LG R971, LG N971, LY N971, LG Q971, LY Q971, LO R971, LY R971 LH N974, LH R974 LS Q976, LO Q976, LY Q976 LO Q996 - Hyper CHIPLED LW Q18S LB Q993, LB Q99A, LB R99A - SideLED LS A670, LO A670, LY A670, LG A670, LP A670 LB A673, LV A673, LT A673, LW A673 LH A674 LY A675 LS A676, LA A676, LO A676, LY A676, LW A676 LS A679, LY A679, LG A679 - Hyper Micro SIDELED® LS Y876, LA Y876, LO Y876, LY Y876 LT Y87S - SmartLED LW L88C, LW L88S LB L89C, LB L89S, LG L890 LS L89K, LO L89K, LY L89K LS L896, LA L896, LO L896, LY L896 - TOPLED LS T670, LO T670, LY T670, LG T670, LP T670 LSG T670, LSP T670, LSY T670, LOP T670, LYG T670 LG T671, LOG T671, LSG T671 LB T673, LV T673, LT T673, LW T673 LH T674 LS T676, LA T676, LO T676, LY T676, LB T676, LH T676, LSB T676, LW T676 LB T67C, LV T67C, LT T67C, LS T67K, LO T67K, LY T67K, LW E67C LS E67B, LA E67B, LO E67B, LY E67B, LB E67C, LV E67C, LT E67C LW T67C LS T679, LY T679, LG T679 LS T770, LO T770, LY T770, LG T770, LP T770 LB T773, LV T773, LT T773, LW T773 LH T774 LS E675, LA E675, LY E675, LS T675 LS T776, LA T776, LO T776, LY T776, LB T776 LHGB T686 LT T68C, LB T68C - Hyper Mini TOPLED® LB M676 - Mini TOPLED Santana® LG M470 LS M47K, LO M47K, LY M47K Source: http://www.osram.convergy.de/
10A10 D_SHOCK = diode:SCHOTTKY-DIODE: Schottky Diode
+3V3 +5V GND SV4-SV11 = con-lstb:MA04-1: PIN HEADER; OC_FARNELL: unknown; OC_NEWARK: unknown
-POWER+ = Block terminal:282836-2: TERM BLOCK 2POS SIDE ENTRY 5MM Check prices <https://pricing.snapeda.com/parts/282836-2/TE%20Connectivity/view-part?ref=eda>; AVAILABILITY: In Stock; CENTERLINE_PITCH: 5 mm[.197 in]; COMMENT: 282836-2; DESCRIPTION: Connector, Terminal Block; Wire Receptacle; 2 Pos.; 16-30 AWG; 0.197 in. CL; Sid; EU_ROHS_COMPLIANCE: Compliant with Exemptions; MF: TE Connectivity; MP: 282836-2; NUMBER_OF_POSITIONS: 2; PACKAGE: None; PRICE: None; PURCHASE-URL: https://pricing.snapeda.com/search/part/282836-2/?ref=eda
A0-A1 A2-A3 A4-A5 A6-A7 A8-A9 A10-A11 A12-A13 A14-A15 = Texas Instruments_By_element14_Batch_1:OPA2350PA: OPERATIONAL AMPLIFIER; MPN: OPA2350PA; OC_FARNELL: 4353316; OC_NEWARK: 75C4730; PACKAGE: PDIP; SUPPLIER: Texas Instruments
ANALOG_PORT = DB37-analog:M37: SUB-D; OC_FARNELL: unknown; OC_NEWARK: unknown
BOARD1-BOARD9 = ESP32-DEVKITV1:ESP32DEVKITV1: https://github.com/shridattdudhat
C1 C2 = resistor:CPOL-US: POLARIZED CAPACITOR, American symbol
C3-C6 C8 C10 C11 C14-C16 C19-C21 C24-C26 C29-C31 C34-C36 C39-C41 C44 C47-C49 C52-C59 = resistor:C-EU: CAPACITOR, European symbol
C7 C12 C17 C22 C27 C32 C37 C42 C45 C50 C51 = rcl:C-EU: CAPACITOR, European symbol; SPICEPREFIX: C
C9 C13 C18 C23 C28 C33 C38 C43 C46 = rcl:CPOL-EU: POLARIZED CAPACITOR, European symbol; SPICEPREFIX: C
CANBUS I2C = Header-M2:MA02-1: PIN HEADER; OC_FARNELL: unknown; OC_NEWARK: unknown
D1-D16 = diode:BAT54S: Schottky Diodes Pin connection corrected 2011-05-04 Source: Fairchild .. BAT54.pdf
DIG_HE_IN = con-lstb:MA08-2: PIN HEADER; OC_FARNELL: unknown; OC_NEWARK: unknown
DIGITAL_PORT = DB37:ASSMANN_WSW_COMPONENTS_ASUB-277-37TP25: CONN D-SUB PLUG/RCPT 37POS R/A; AUTOMOTIVE: No; CENTROID_NOT_SPECIFIED: No; CONN_ORIENTATION: Right Angle; CONTACT_MATERIAL: Gold,Nickel; CURRENT_RATING: 3A; DATASHEET: http://www.assmann-wsw.com/fileadmin/datasheets/ASS_6549_CO.pdf; DEVICE_CLASS_L1: Connectors; DEVICE_CLASS_L2: D-Sub Connectors; DEVICE_CLASS_L3: unset; DIGIKEY_DESCRIPTION: CONN D-SUB PLUG/RCPT 37POS R/A; DIGIKEY_PART_NUMBER: AE10967-ND; FOOTPRINT_VARIANT_NAME_0: Recommended_Land_Pattern; HEIGHT: 32.05mm; IS_FEMALE: yes; LEAD_FREE: Yes; MF: ASSMANN WSW Components; MFG_PACKAGE_IDENT: 0; MFG_PACKAGE_IDENT_DATE: 0; MFG_PACKAGE_IDENT_REV: 0; MPN: ASUB-277-37TP25; NUMBER_OF_CONTACTS: 74; PACKAGE: CONN_D-SUB37_DUAL; PITCH: 2.77mm; PREFIX: J; ROHS: Yes; SHIELDING: true; TEMPERATURE_RANGE_HIGH: +105°C; TEMPERATURE_RANGE_LOW: -55°C; VERIFICATION_VERSION: 0.0.0.3; VOLTAGE_RATING: 250V
FT232LB = FT232BL:FT232BL: FT232BL MODULE; OC_FARNELL: unknown; OC_NEWARK: unknown
FUSE = fuse:FUSE: Fuse; OC_FARNELL: unknown; OC_NEWARK: unknown
IC2 = SamacSys_Parts:LM317T: Standard Regulator 1.2V to 37V 1.5A STMicroelectronics LM317T, Single Linear Voltage Regulator, 1.5A Adjustable 1.2 37 V, 3-Pin TO-220 Source: Datasheet <http://www.st.com/web/en/resource/technical/document/datasheet/CD00000455.pdf>; DESCRIPTION: Standard Regulator 1.2V to 37V 1.5A STMicroelectronics LM317T, Single Linear Voltage Regulator, 1.5A Adjustable 1.2 37 V, 3-Pin TO-220; HEIGHT: 4.6mm; MANUFACTURER_NAME: STMicroelectronics; MANUFACTURER_PART_NUMBER: LM317T; MOUSER_PART_NUMBER: 511-LM317T; MOUSER_PRICE-STOCK: https://www.mouser.co.uk/ProductDetail/STMicroelectronics/LM317T?qs=swDD%252BF%252Bps7c8uLyY%252B3mJJw%3D%3D
MCP2515_MOD1-MCP2515_MOD9 = mcp2515:MCP2515: MCP2515 MODULE; OC_FARNELL: unknown; OC_NEWARK: unknown
S_M1-S_M9 SERIAL = pinhead:PINHD-1X2: PIN HEADER
S_RASP = special:SW_DIP-2: DIP SWITCH
SCR = SamacSys_Parts:TYN608RG: STMICROELECTRONICS - TYN608RG - Thyristor, 600 V, 15 mA, 5 A, 8 A, TO-220AB, 3 Pins Source: Datasheet <http://www.st.com/web/en/resource/technical/document/datasheet/CD00002270.pdf>; DESCRIPTION: STMICROELECTRONICS - TYN608RG - Thyristor, 600 V, 15 mA, 5 A, 8 A, TO-220AB, 3 Pins; HEIGHT: 4.6mm; MANUFACTURER_NAME: STMicroelectronics; MANUFACTURER_PART_NUMBER: TYN608RG; MOUSER_PART_NUMBER: 511-TYN608; MOUSER_PRICE-STOCK: https://www.mouser.co.uk/ProductDetail/STMicroelectronics/TYN608RG?qs=nKw3P5Zvyeo6xazhIIbUlQ%3D%3D
SV1 SV2 = con-lstb:MA04-2: PIN HEADER; OC_FARNELL: unknown; OC_NEWARK: unknown
SV3 = con-lstb:MA20-2: PIN HEADER; OC_FARNELL: unknown; OC_NEWARK: unknown
SV12 = con-lstb:MA08-1: PIN HEADER; OC_FARNELL: unknown; OC_NEWARK: unknown
SW_3V3 SW_GENRL SW_MOD1-SW_MOD9 = switch:M9040P: TOGGLE SWITCH Marquardt
TRANS_1 TRANS_2 = lc245a:SN74LVC245AN; DATASHEET_URL: http://www.ti.com/lit/gpn/SN74LVC245A; DESCRIPTION: Octal Bus Transceiver With 3-State Outputs; FAMILY_NAME: STANDARD TRANSCEIVER; GENERIC_PART_NUMBER: SN74LVC245A; INDUSTRY_STD_PKG_TYPE: PDIP; MANUFACTURER: Texas Instruments; MANUFACTURER_PART_NUMBER: SN74LVC245AN; PACKAGE_DESIGNATOR: N; PIN_COUNT: 20; VENDOR: Texas Instruments
X1 = raspberrypi_bastelstube_v13:RASPI_GPIO_B+: Only the 2x20 header connector, nothing else
X2 = Rasp_board:RASPI_BOARD_B+#: Raspberry Pi GPIO connector with markings for the outer dimensions of the Raspberry Pi board model B+ with different sets of drill holes or mounting pads All pins connected
Z5.1 = diode:ZENER-DIODE: Z-Diode